# EAGLE board xio3 (EAGLE 9.4.2), part 1 of 3
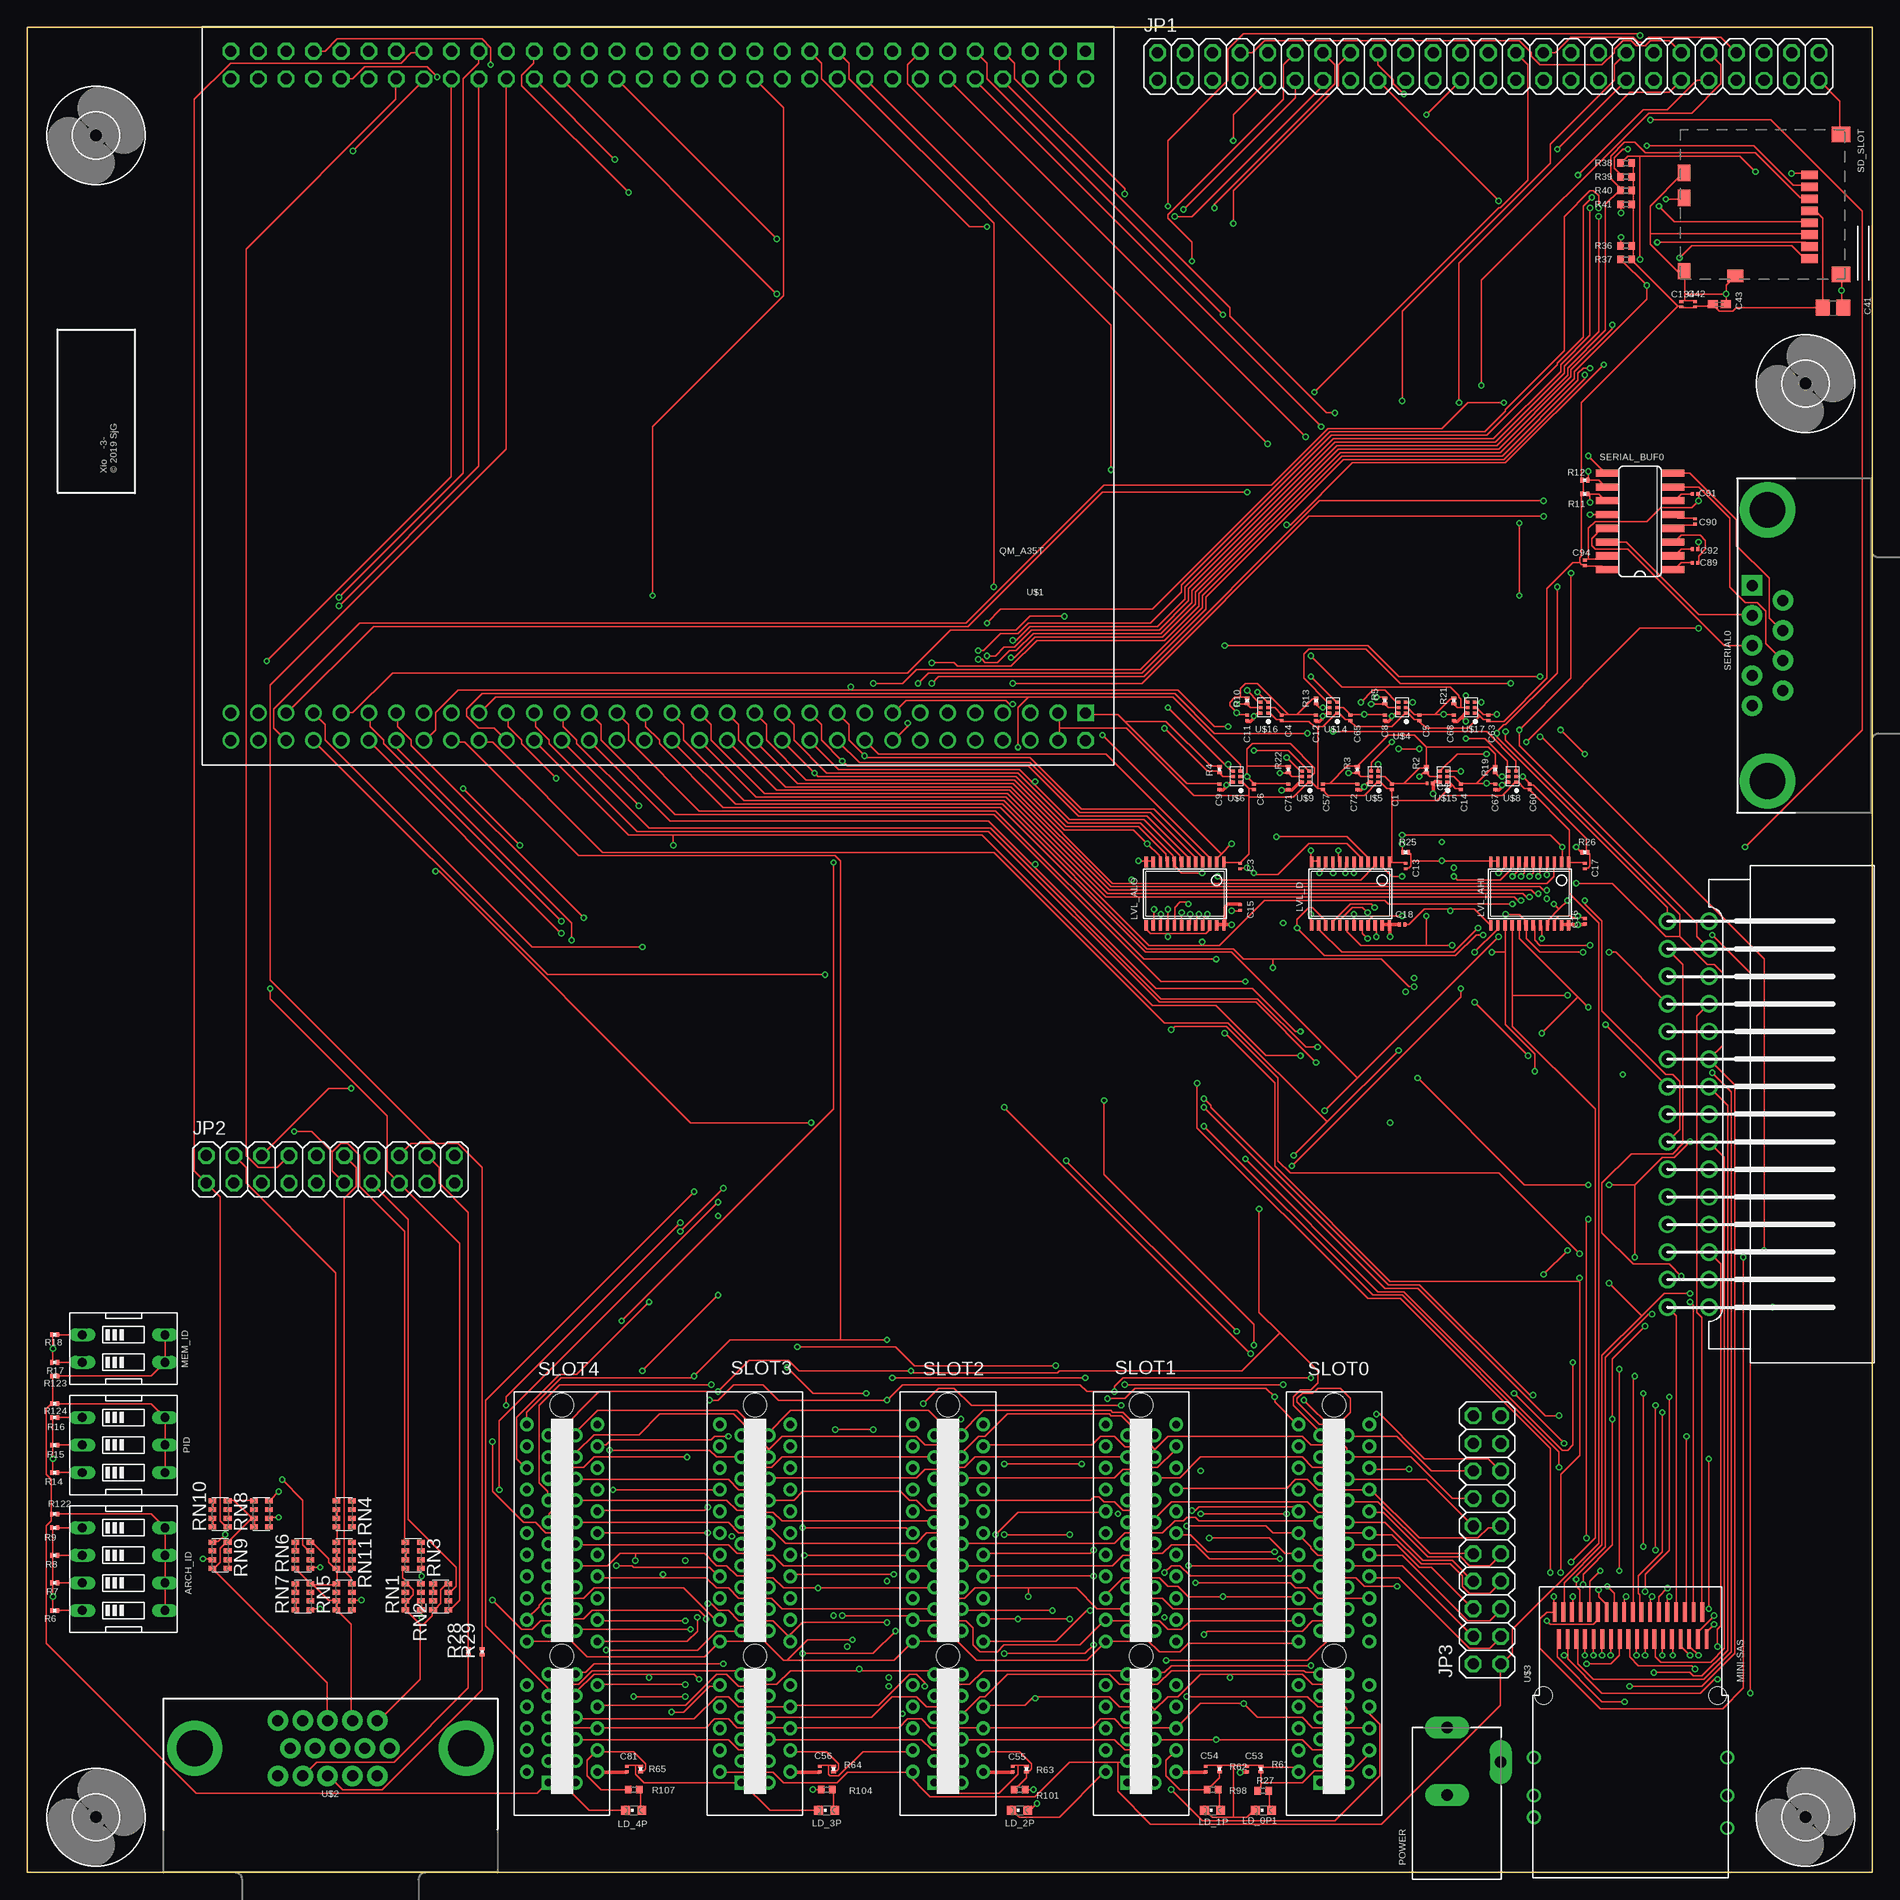
[diagram p14: board, top side]
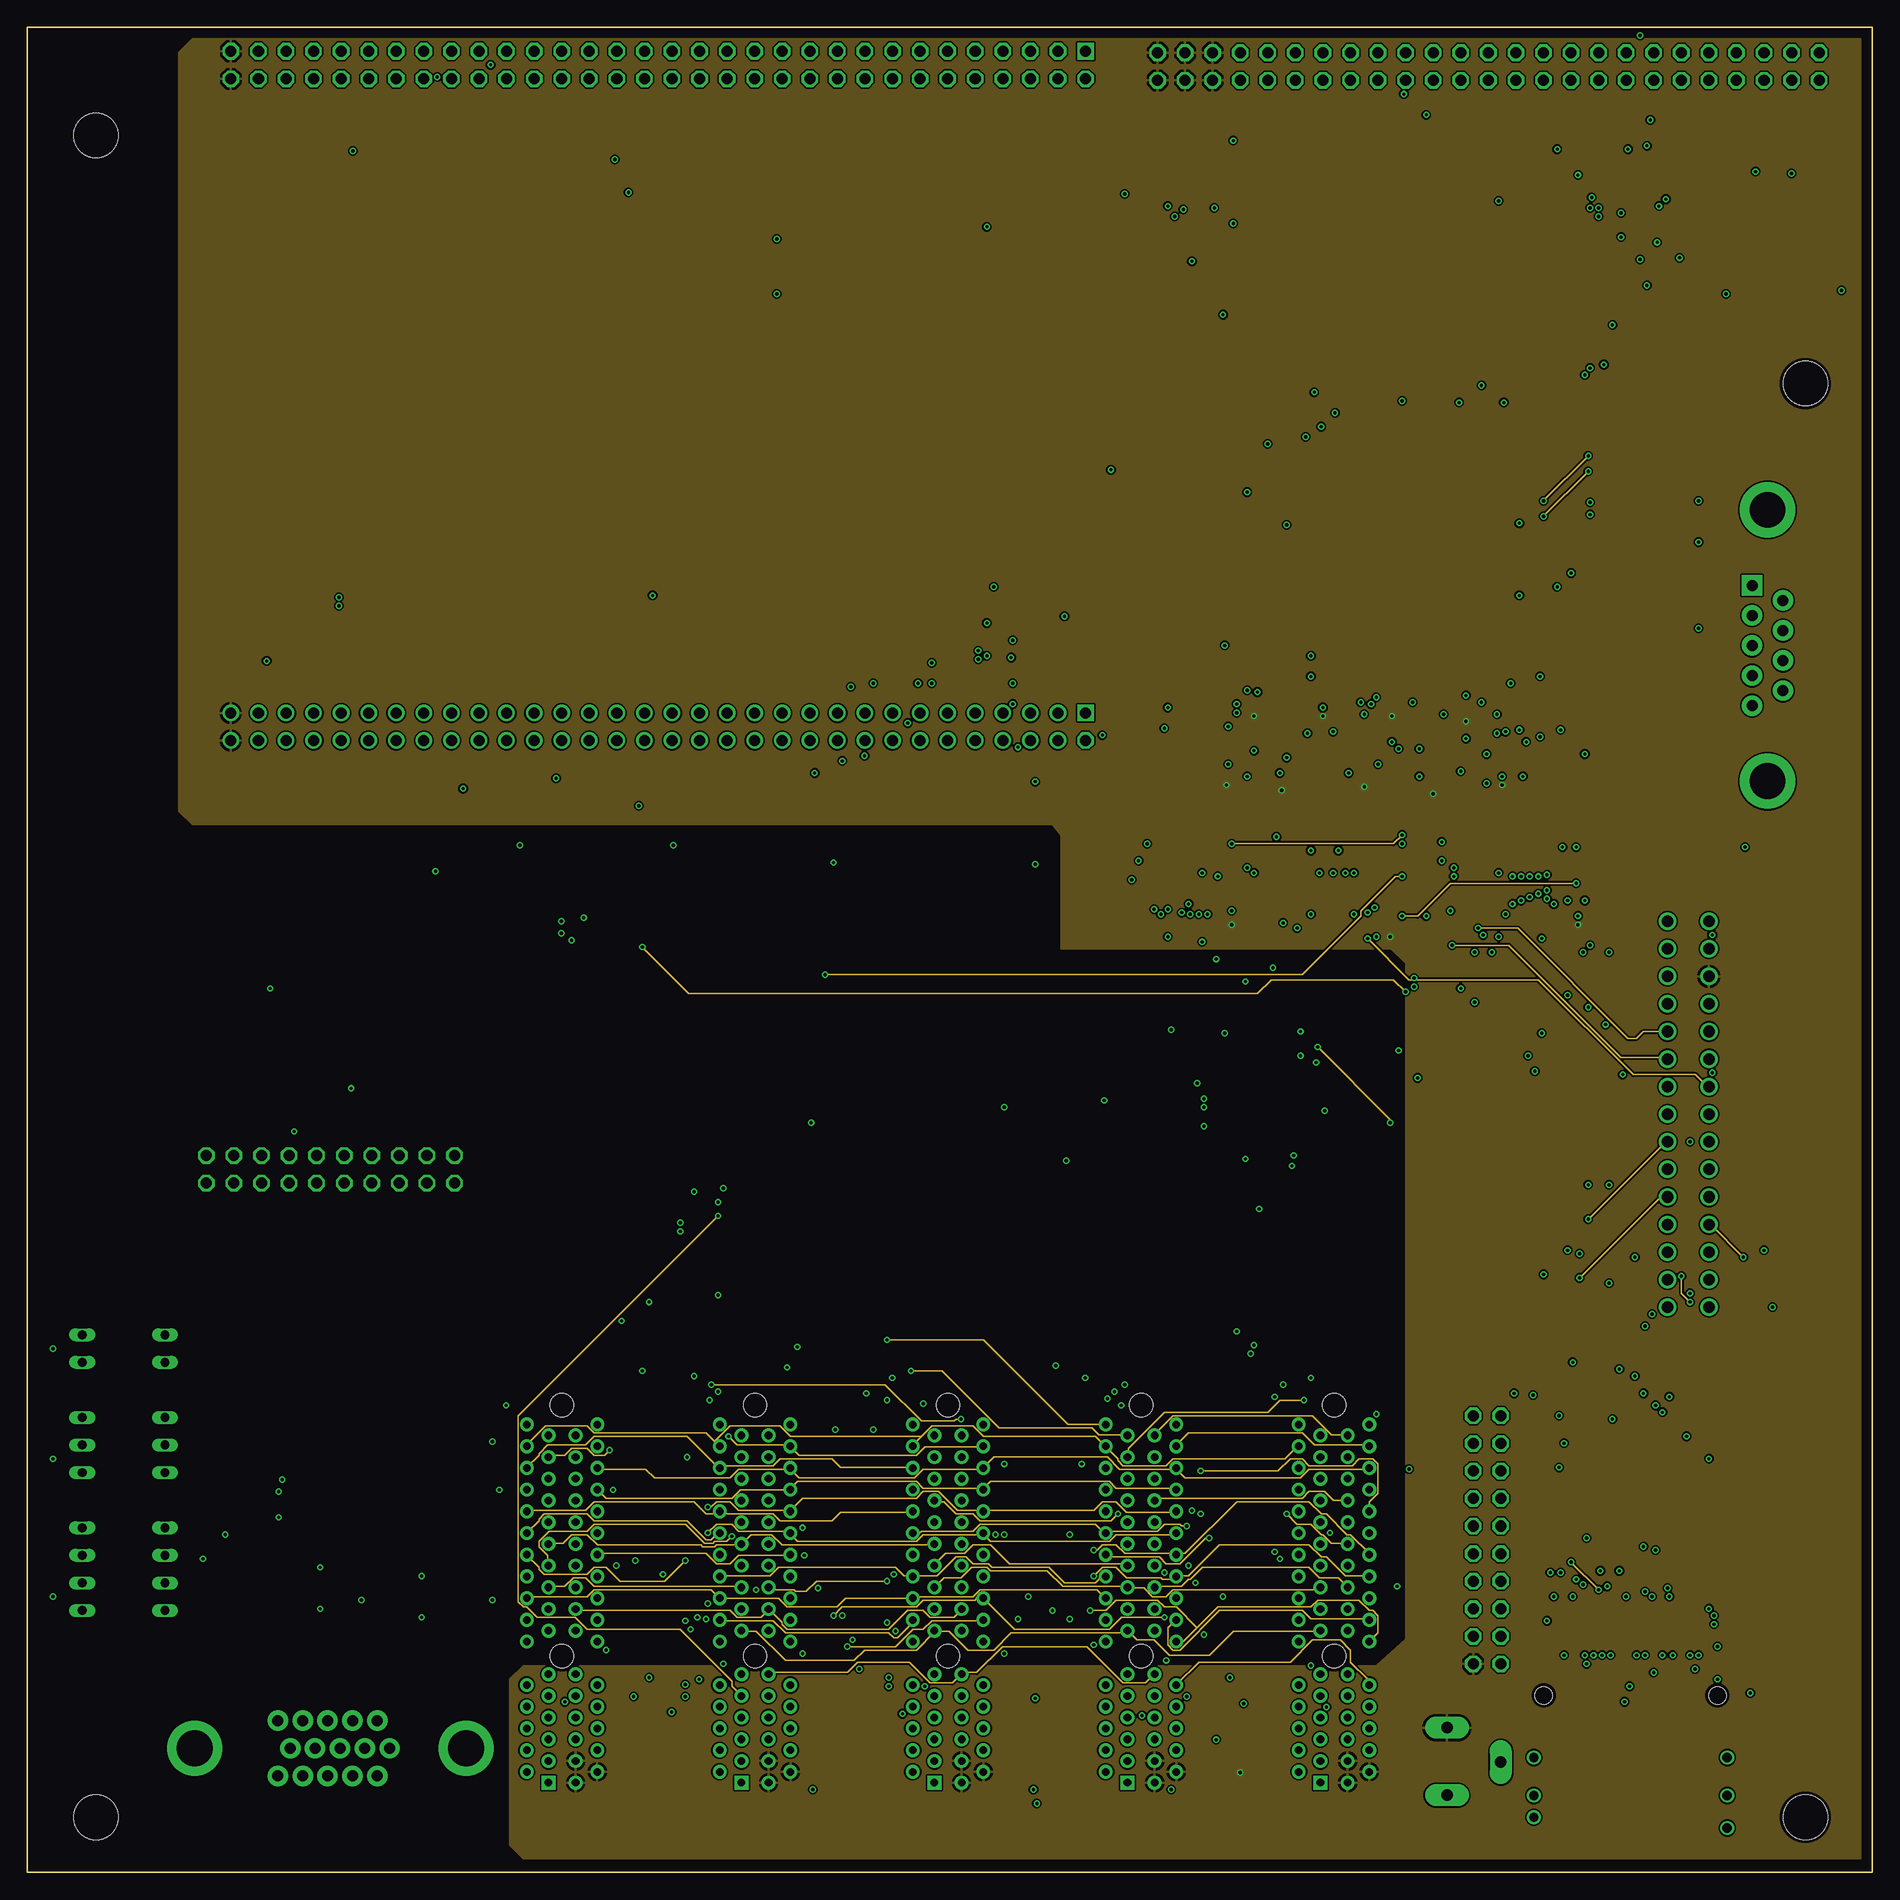
[diagram p15: board, inner layer Route2]
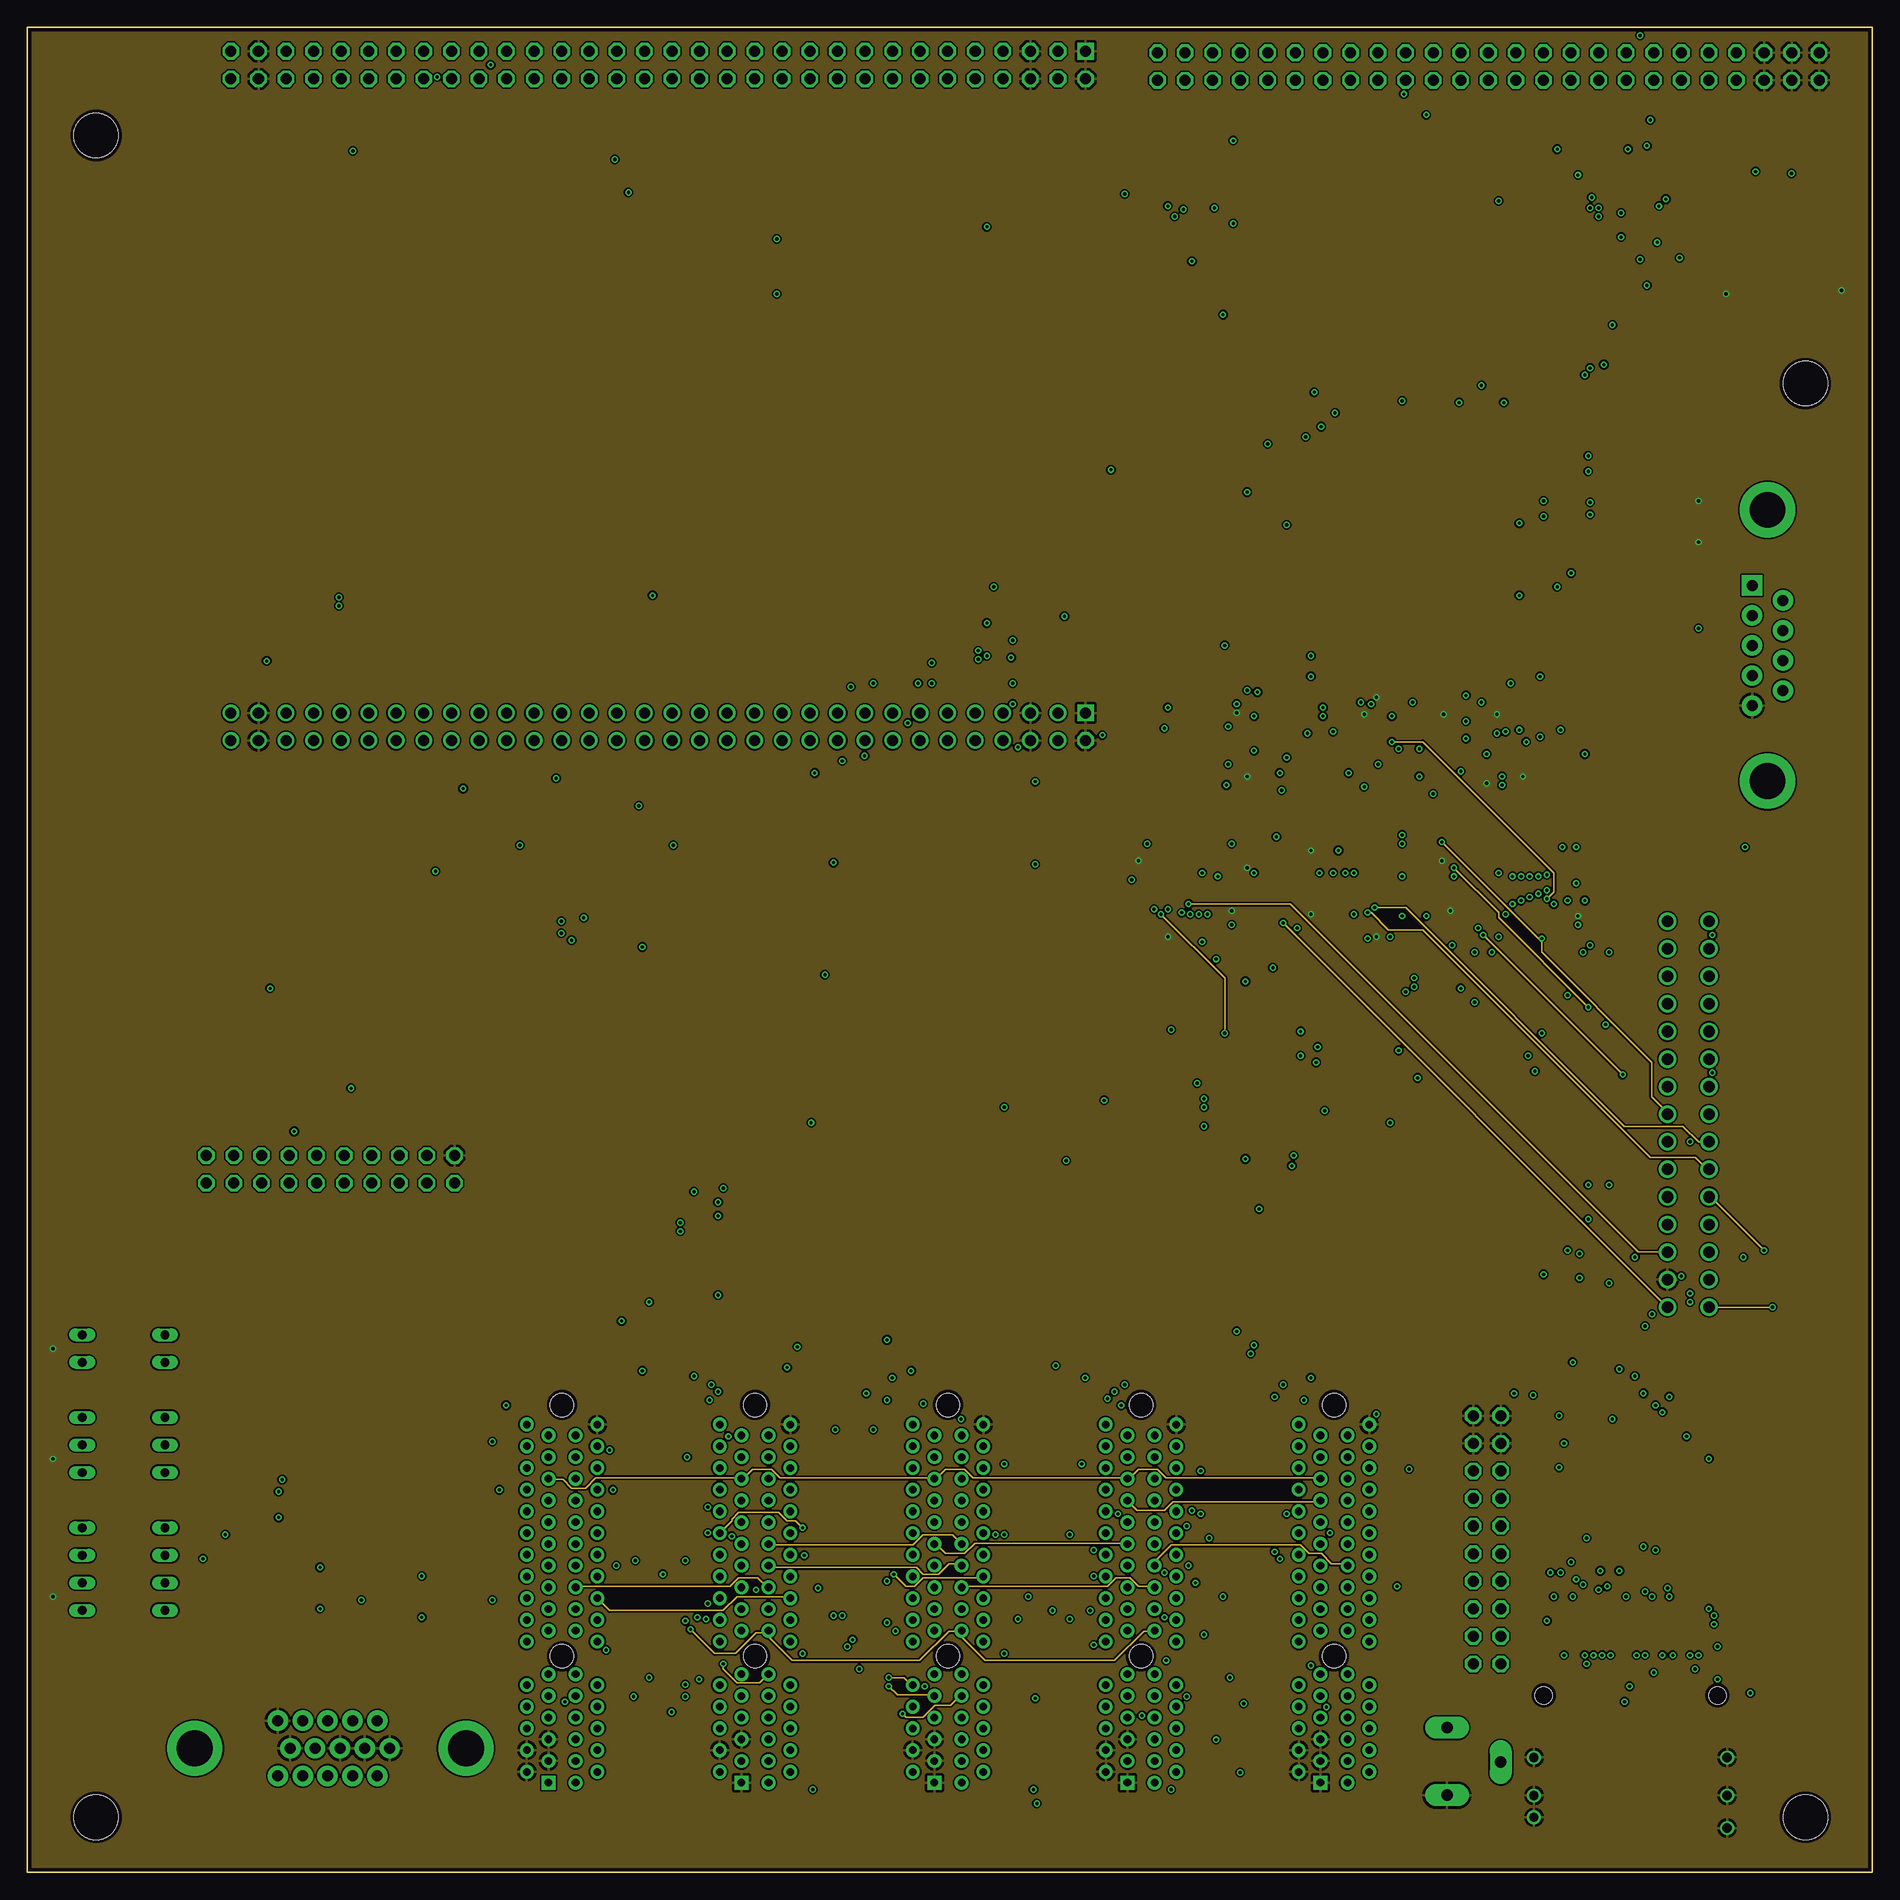
[diagram p16: board, inner layer Route15]
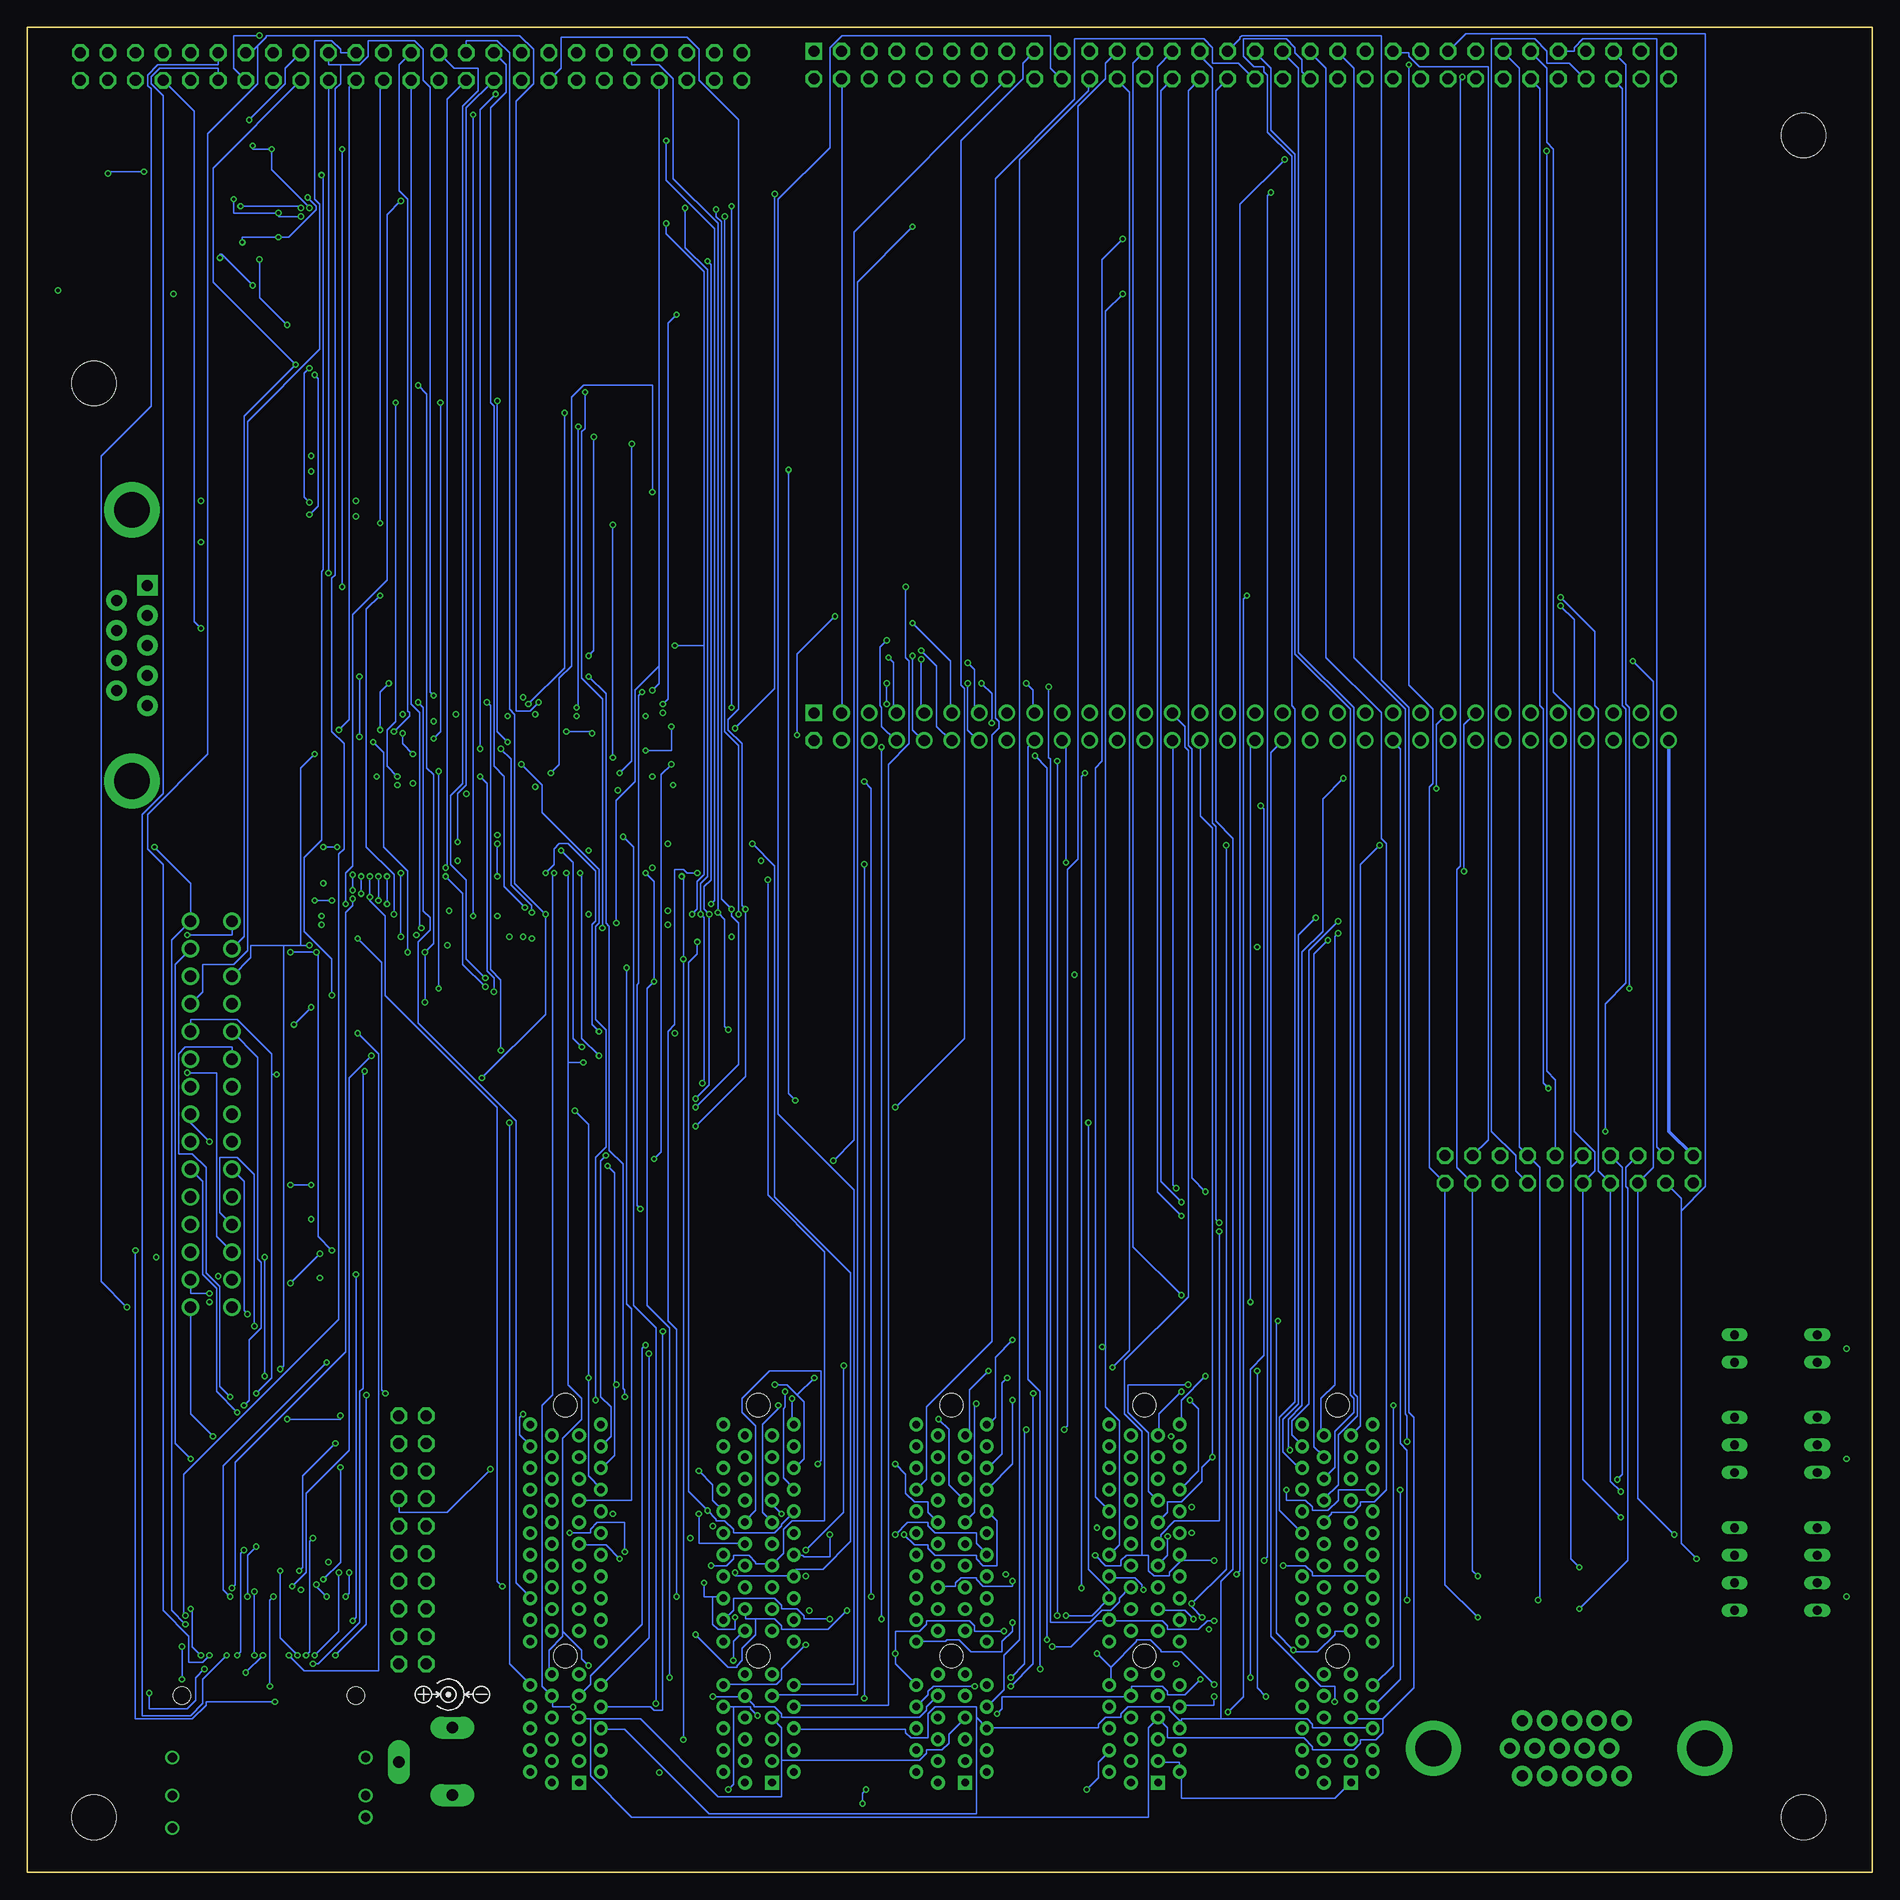
[diagram p17: board, bottom side, seen from below]

Size 170 x 170 mm. Coordinates in mm from the lower left corner, seen from the top.
Outline: 0,170 170,170 170,0 0,0 0,170
Copper layers (1+2*15+16): Top 0.035mm / dielectric 0.2mm / Route2 0.017mm / dielectric 1.2mm / Route15 0.017mm / dielectric 0.2mm / Bottom 0.035mm
Design rules "seed-4layer-6.6": minimum track width 6mil, minimum drill 0.3mm, track to track 6mil, track to pad 6mil, pad to pad 6mil, via to via 6mil, smd to smd 0mil, copper to edge 12mil, drill to drill 12mil, minimum pad ring 6mil, minimum via ring 5.5mil, stop-mask expansion 4mil, vias tented up to drill 25mil, thermal gap 10mil
Net classes: 1 Power: width 0.305 mm, drill 0.203 mm; 2 Slot-power: width 0.508 mm; 3 tx100: width 0.254 mm, clearance 0.457 mm; 4 usb90: width 0.254 mm, clearance 0.178 mm; 5 cclk50: width 0.203 mm; 6 3v3: width 0.254 mm; 7 vccint_aux: width 0.305 mm; 14 qspi: width 0.203 mm

## Footprints (pad centres in the part's own frame; a part is rotated, then mirrored left to right if it is on the bottom)
EDG-04 = drill 0.813 long: 1 -3.81,-3.81; 2 -1.27,-3.81; 3 1.27,-3.81; 4 3.81,-3.81; 5 3.81,3.81; 6 1.27,3.81; 7 -1.27,3.81; 8 -3.81,3.81
C0201 = smd 0.25 x 0.35: 1 -0.25,0; 2 0.25,0
C0805 = smd 1.3 x 1.5: 1 -0.95,0; 2 0.95,0
C0402K = smd 0.925 x 0.74: 1 -0.6,0; 2 0.6,0
A8_CART = drill 1.067: P1 -17.78,6.35; P2 -15.24,6.35; P3 -12.7,6.35; P4 -10.16,6.35; P5 -7.62,6.35; P6 -5.08,6.35; P7 -2.54,6.35; P8 0,6.35; P9 2.54,6.35; P10 5.08,6.35; P11 7.62,6.35; P12 10.16,6.35; P13 12.7,6.35; P14 15.24,6.35; P15 17.78,6.35; PA -17.78,10.16; PB -15.24,10.16; PC -12.7,10.16; PD -10.16,10.16; PE -7.62,10.16; PF -5.08,10.16; PH -2.54,10.16; PJ 0,10.16; PK 2.54,10.16; PL 5.08,10.16; PM 7.62,10.16; PN 10.16,10.16; PP 12.7,10.16; PR 15.24,10.16; PS 17.78,10.16
4,1 = hole 4.1: 0,0
2X25 = drill 1.016 octagon: 1 -30.48,-1.27; 2 -30.48,1.27; 3 -27.94,-1.27; 4 -27.94,1.27; 5 -25.4,-1.27; 6 -25.4,1.27; 7 -22.86,-1.27; 8 -22.86,1.27; 9 -20.32,-1.27; 10 -20.32,1.27; 11 -17.78,-1.27; 12 -17.78,1.27; 13 -15.24,-1.27; 14 -15.24,1.27; 15 -12.7,-1.27; 16 -12.7,1.27; 17 -10.16,-1.27; 18 -10.16,1.27; 19 -7.62,-1.27; 20 -7.62,1.27; 21 -5.08,-1.27; 22 -5.08,1.27; 23 -2.54,-1.27; 24 -2.54,1.27; 25 0,-1.27; 26 0,1.27; 27 2.54,-1.27; 28 2.54,1.27; 29 5.08,-1.27; 30 5.08,1.27; 31 7.62,-1.27; 32 7.62,1.27; 33 10.16,-1.27; 34 10.16,1.27; 35 12.7,-1.27; 36 12.7,1.27; 37 15.24,-1.27; 38 15.24,1.27; 39 17.78,-1.27; 40 17.78,1.27; 41 20.32,-1.27; 42 20.32,1.27; 43 22.86,-1.27; 44 22.86,1.27; 45 25.4,-1.27; 46 25.4,1.27; 47 27.94,-1.27; 48 27.94,1.27; 49 30.48,-1.27; 50 30.48,1.27
2X10 = drill 1.016 octagon: 1 -11.43,-1.27; 2 -11.43,1.27; 3 -8.89,-1.27; 4 -8.89,1.27; 5 -6.35,-1.27; 6 -6.35,1.27; 7 -3.81,-1.27; 8 -3.81,1.27; 9 -1.27,-1.27; 10 -1.27,1.27; 11 1.27,-1.27; 12 1.27,1.27; 13 3.81,-1.27; 14 3.81,1.27; 15 6.35,-1.27; 16 6.35,1.27; 17 8.89,-1.27; 18 8.89,1.27; 19 11.43,-1.27; 20 11.43,1.27
CHIPLED_0603 = smd 0.8 x 0.8: A 0,-0.75; C 0,0.75
TSSOP24 = smd 0.305 x 0.991: 1 -3.575,-2.918; 2 -2.925,-2.918; 3 -2.275,-2.918; 4 -1.625,-2.918; 5 -0.975,-2.918; 6 -0.325,-2.918; 7 0.325,-2.918; 8 0.975,-2.918; 9 1.625,-2.918; 10 2.275,-2.918; 11 2.925,-2.918; 12 3.575,-2.918; 13 3.575,2.918; 14 2.925,2.918; 15 2.275,2.918; 16 1.625,2.918; 17 0.975,2.918; 18 0.325,2.918; 19 -0.325,2.918; 20 -0.975,2.918; 21 -1.625,2.918; 22 -2.275,2.918; 23 -2.925,2.918; 24 -3.575,2.918
EDG-02 = drill 0.813 long: 1 -1.27,-3.81; 2 1.27,-3.81; 3 1.27,3.81; 4 -1.27,3.81
EDG-03 = drill 0.813 long: 1 -2.54,-3.81; 2 0,-3.81; 3 2.54,-3.81; 4 2.54,3.81; 5 0,3.81; 6 -2.54,3.81
DCJ3P-14.2X11.0X9.0MM = drill 1.067 pad 2.032 long: + 3.175,0; -1 -3.048,0; -2 0,-4.953
R0201 = smd 0.28 x 0.43: 1 -0.255,0; 2 0.255,0
R0402 = smd 0.6 x 0.7: 1 -0.5,0; 2 0.5,0
ACAS0612 = smd 0.45 x 0.7: 1A -1.2,-0.7; 1B -1.2,0.7; 2A -0.4,-0.7; 2B -0.4,0.7; 3A 0.4,-0.7; 3B 0.4,0.7; 4A 1.2,-0.7; 4B 1.2,0.7
5025700893 = smd 1.5 x 1.15: DTCT -0.6,-7.375; GND1 6.15,-7.375; GND3 -2.9,-7.375 | smd 1.4 x 1.7: GND0 6.45,7.1; GND2 -6.45,7.1 | smd 1.15 x 1.5: GND4 6.575,-2.65 | smd 0.8 x 1.5: P$1 -2.7,4.2; P$2 -1.6,4.2; P$3 -0.5,4.2; P$4 0.6,4.2; P$5 1.7,4.2; P$6 2.8,4.2; P$7 3.9,4.2; P$8 5,4.2
DB9 = drill 1.016 pad 1.88 square: 1 -5.54,-1.42 | drill 1.016 pad 1.88: 2 -2.77,-1.42; 3 0,-1.42; 4 2.77,-1.42; 5 5.54,-1.42; 6 -4.15,1.42; 7 -1.38,1.42; 8 1.38,1.42; 9 4.15,1.42 | drill 3.302 pad 5.08: G1 -12.5,0; G2 12.5,0
SO16 = smd 0.66 x 2.032: 1 -4.445,-3.073; 2 -3.175,-3.073; 3 -1.905,-3.073; 4 -0.635,-3.073; 5 0.635,-3.073; 6 1.905,-3.073; 7 3.175,-3.073; 8 4.445,-3.073; 9 4.445,3.073; 10 3.175,3.073; 11 1.905,3.073; 12 0.635,3.073; 13 -0.635,3.073; 14 -1.905,3.073; 15 -3.175,3.073; 16 -4.445,3.073
PCI-E_64 = drill 0.7 pad 1.27 square: A1 -12.06,1.5 | drill 0.7 pad 1.27: A2 -11.06,3.5; A3 -10.06,1.5; A4 -9.06,3.5; A5 -8.06,1.5; A6 -7.06,3.5; A7 -6.06,1.5; A8 -5.06,3.5; A9 -4.06,1.5; A10 -3.06,3.5; A11 -2.06,1.5; A12 0.94,3.5; A13 1.94,1.5; A14 2.94,3.5; A15 3.94,1.5; A16 4.94,3.5; A17 5.94,1.5; A18 6.94,3.5; A19 7.94,1.5; A20 8.94,3.5; A21 9.94,1.5; A22 10.94,3.5; A23 11.94,1.5; A24 12.94,3.5; A25 13.94,1.5; A26 14.94,3.5; A27 15.94,1.5; A28 16.94,3.5; A29 17.94,1.5; A30 18.94,3.5; A31 19.94,1.5; A32 20.94,3.5; B1 -12.06,-1; B2 -11.06,-3; B3 -10.06,-1; B4 -9.06,-3; B5 -8.06,-1; B6 -7.06,-3; B7 -6.06,-1; B8 -5.06,-3; B9 -4.06,-1; B10 -3.06,-3; B11 -2.06,-1; B12 0.94,-3; B13 1.94,-1; B14 2.94,-3; B15 3.94,-1; B16 4.94,-3; B17 5.94,-1; B18 6.94,-3; B19 7.94,-1; B20 8.94,-3; B21 9.94,-1; B22 10.94,-3; B23 11.94,-1; B24 12.94,-3; B25 13.94,-1; B26 14.94,-3; B27 15.94,-1; B28 16.94,-3; B29 17.94,-1; B30 18.94,-3; B31 19.94,-1; B32 20.94,-3 | hole 2.15: -0.41,0.25; 22.74,0.25
QMTECH = drill 1.016 square: U7_1 -39.37,29.21; U8_1 -39.37,-31.75 | drill 1.016 octagon: U7_2 -39.37,31.75; U8_2 -39.37,-29.21; U8_3 -36.83,-31.75; U8_4 -36.83,-29.21; U8_5 -34.29,-31.75; U8_6 -34.29,-29.21; U8_7 -31.75,-31.75; U8_8 -31.75,-29.21; U8_9 -29.21,-31.75; U8_10 -29.21,-29.21; U8_11 -26.67,-31.75; U8_12 -26.67,-29.21; U8_13 -24.13,-31.75; U8_14 -24.13,-29.21; U8_15 -21.59,-31.75; U8_16 -21.59,-29.21; U8_17 -19.05,-31.75; U8_18 -19.05,-29.21; U8_19 -16.51,-31.75; U8_20 -16.51,-29.21; U8_21 -13.97,-31.75; U8_22 -13.97,-29.21; U8_23 -11.43,-31.75; U8_24 -11.43,-29.21; U8_25 -8.89,-31.75; U8_26 -8.89,-29.21; U8_27 -6.35,-31.75; U8_28 -6.35,-29.21; U8_29 -3.81,-31.75; U8_30 -3.81,-29.21; U8_31 -1.27,-31.75; U8_32 -1.27,-29.21; U8_33 1.27,-31.75; U8_34 1.27,-29.21; U8_35 3.81,-31.75; U8_36 3.81,-29.21; U8_37 6.35,-31.75; U8_38 6.35,-29.21; U8_39 8.89,-31.75; U8_40 8.89,-29.21; U8_41 11.43,-31.75; U8_42 11.43,-29.21; U8_43 13.97,-31.75; U8_44 13.97,-29.21; U8_45 16.51,-31.75; U8_46 16.51,-29.21; U8_47 19.05,-31.75; U8_48 19.05,-29.21; U8_49 21.59,-31.75; U8_50 21.59,-29.21; U8_51 24.13,-31.75; U8_52 24.13,-29.21; U8_53 26.67,-31.75; U8_54 26.67,-29.21; U8_55 29.21,-31.75; U8_56 29.21,-29.21; U8_57 31.75,-31.75; U8_58 31.75,-29.21; U8_59 34.29,-31.75; U8_60 34.29,-29.21; U8_61 36.83,-31.75; U8_62 36.83,-29.21; U8_63 39.37,-31.75; U8_64 39.37,-29.21 | drill 1.016: U7_3 -36.83,29.21; U7_4 -36.83,31.75; U7_5 -34.29,29.21; U7_6 -34.29,31.75; U7_7 -31.75,29.21; U7_8 -31.75,31.75; U7_9 -29.21,29.21; U7_10 -29.21,31.75; U7_11 -26.67,29.21; U7_12 -26.67,31.75; U7_13 -24.13,29.21; U7_14 -24.13,31.75; U7_15 -21.59,29.21; U7_16 -21.59,31.75; U7_17 -19.05,29.21; U7_18 -19.05,31.75; U7_19 -16.51,29.21; U7_20 -16.51,31.75; U7_21 -13.97,29.21; U7_22 -13.97,31.75; U7_23 -11.43,29.21; U7_24 -11.43,31.75; U7_25 -8.89,29.21; U7_26 -8.89,31.75; U7_27 -6.35,29.21; U7_28 -6.35,31.75; U7_29 -3.81,29.21; U7_30 -3.81,31.75; U7_31 -1.27,29.21; U7_32 -1.27,31.75; U7_33 1.27,29.21; U7_34 1.27,31.75; U7_35 3.81,29.21; U7_36 3.81,31.75; U7_37 6.35,29.21; U7_38 6.35,31.75; U7_39 8.89,29.21; U7_40 8.89,31.75; U7_41 11.43,29.21; U7_42 11.43,31.75; U7_43 13.97,29.21; U7_44 13.97,31.75; U7_45 16.51,29.21; U7_46 16.51,31.75; U7_47 19.05,29.21; U7_48 19.05,31.75; U7_49 21.59,29.21; U7_50 21.59,31.75; U7_51 24.13,29.21; U7_52 24.13,31.75; U7_53 26.67,29.21; U7_54 26.67,31.75; U7_55 29.21,29.21; U7_56 29.21,31.75; U7_57 31.75,29.21; U7_58 31.75,31.75; U7_59 34.29,29.21; U7_60 34.29,31.75; U7_61 36.83,29.21; U7_62 36.83,31.75; U7_63 39.37,29.21; U7_64 39.37,31.75
DB15 = drill 1.016 pad 1.88: 1 -4.32,-7.62; 2 -2.03,-7.62; 3 0.26,-7.62; 4 2.55,-7.62; 5 4.84,-7.62; 6 -5.46,-5.08; 7 -3.17,-5.08; 8 -0.88,-5.08; 9 1.41,-5.08; 10 3.7,-5.08; 11 -4.32,-2.54; 12 -2.03,-2.54; 13 0.26,-2.54; 14 2.55,-2.54; 15 4.84,-2.54 | drill 3.302 pad 5.08: G1 -12.5,-5.08; G2 12.5,-5.08
MINI-SAS = smd 0.35 x 1.8: PA1 -6.2,8.78; PA2 -5.4,8.78; PA3 -4.6,8.78; PA4 -3.8,8.78; PA5 -3,8.78; PA6 -2.2,8.78; PA7 -1.4,8.78; PA8 -0.6,8.78; PA9 0.2,8.78; PA10 1,8.78; PA11 1.8,8.78; PA12 2.6,8.78; PA13 3.4,8.78; PA14 4.2,8.78; PA15 5,8.78; PA16 5.8,8.78; PA17 6.6,8.78; PA18 7.4,8.78; PB1 -6.6,11.29; PB2 -5.8,11.29; PB3 -5,11.29; PB4 -4.2,11.29; PB5 -3.4,11.29; PB6 -2.6,11.29; PB7 -1.8,11.29; PB8 -1,11.29; PB9 -0.2,11.29; PB10 0.6,11.29; PB11 1.4,11.29; PB12 2.2,11.29; PB13 3,11.29; PB14 3.8,11.29; PB15 4.6,11.29; PB16 5.4,11.29; PB17 6.2,11.29; PB18 7,11.29 | drill 0.85: SHIELD1 -8.5,-2.12; SHIELD2 -8.5,-5.62; SHIELD3 -8.5,-7.62; SHIELD4 9.3,-2.12; SHIELD5 9.3,-5.62; SHIELD6 9.3,-8.62 | hole 1.6: -7.6,3.6; 8.4,3.6
SOT886 = smd 0.325 x 0.27: 1 -0.338,0.5; 2 -0.338,0; 3 -0.338,-0.5; 4 0.338,-0.5; 5 0.338,0; 6 0.338,0.5

## Placement (x,y rotation side)
ARCH_ID  209-4MS  [EDG-04]  8.89,27.94 270 top
C1  0.1uF  [C0201]  125.73,100.01 90 top
C2  0.1uF  [C0201]  129.22,100.33 180 top
C3  0.1uF  [C0201]  111.76,92.71 270 top
C4  0.1uF  [C0201]  115.57,106.36 90 top
C5  0.1uF  [C0201]  128.27,106.36 90 top
C6  0.1uF  [C0201]  113.03,100.01 90 top
C8  0.1uF  [C0201]  125.09,106.36 90 top
C9  0.1uF  [C0201]  109.86,100.01 90 top
C11  0.1uF  [C0201]  112.39,106.36 90 top
C12  0.1uF  [C0201]  118.75,106.36 90 top
C13  0.1uF  [C0201]  127,92.71 270 top
C14  0.1uF  [C0201]  132.08,100.01 90 top
C15  0.1uF  [C0201]  111.76,88.9 270 top
C16  0.1uF  [C0201]  143.51,87.63 90 top
C17  0.1uF  [C0201]  143.51,92.71 270 top
C18  0.1uF  [C0201]  126.68,87.31 0 top
C41  22uF  [C0805]  166.37,144.15 0 top
C42  1uF  [C0201]  153.67,144.46 90 top
C43  10uF  [C0402K]  155.89,144.46 0 top
C53  0.1uF  [C0201]  112.39,9.53 90 top
C54  0.1uF  [C0201]  108.58,9.53 90 top
C55  0.1uF  [C0201]  90.81,9.53 90 top
C56  0.1uF  [C0201]  73.03,9.53 90 top
C57  0.1uF  [C0201]  119.38,100.01 90 top
C60  0.1uF  [C0201]  138.43,100.01 90 top
C63  0.1uF  [C0201]  134.62,106.36 90 top
C65  0.1uF  [C0201]  121.92,106.36 90 top
C67  0.1uF  [C0201]  135.25,100.01 90 top
C68  0.1uF  [C0201]  131.44,106.36 90 top
C71  0.1uF  [C0201]  116.2,100.01 90 top
C72  0.1uF  [C0201]  122.56,100.01 90 top
C81  0.1uF  [C0201]  55.24,9.53 90 top
C89  0.1uF  [C0201]  153.67,120.65 180 top
C90  0.1uF  [C0201]  153.67,124.46 270 top
C91  0.1uF  [C0201]  153.67,127 0 top
C92  0.1uF  [C0201]  153.67,121.92 0 top
C94  0.1uF  [C0201]  143.51,120.65 270 top
C134  0.1uF  [C0201]  152.4,144.46 270 top
CARTRIDGE  5650118-1  [A8_CART]  161.29,69.85 90 top
H3  MOUNT-HOLE4.1  [4,1]  6.35,5.08 0 top
H6  MOUNT-HOLE4.1  [4,1]  6.35,160.02 0 top
H7  MOUNT-HOLE4.1  [4,1]  163.83,137.16 0 top
H8  MOUNT-HOLE4.1  [4,1]  163.83,5.08 0 top
JP1  [2X25]  134.62,166.37 0 top
JP2  [2X10]  27.94,64.77 0 top
JP3  [2X10]  134.5,30.63 90 top
LD_0P1  SML-D12D1WT86  [CHIPLED_0603]  113.92,5.71 90 top
LD_1P  SML-D12D1WT86  [CHIPLED_0603]  109.22,5.71 90 top
LD_2P  SML-D12D1WT86  [CHIPLED_0603]  91.44,5.71 90 top
LD_3P  SML-D12D1WT86  [CHIPLED_0603]  73.66,5.71 90 top
LD_4P  SML-D12D1WT86  [CHIPLED_0603]  55.88,5.71 90 top
LVL_AHI  SN74LVC8T245  [TSSOP24]  138.43,90.17 180 top
LVL_ALO  SN74LVC8T245  [TSSOP24]  106.68,90.17 180 top
LVL_D  SN74LVC8T245  [TSSOP24]  121.92,90.17 180 top
MEM_ID  209-2MS  [EDG-02]  8.89,48.26 270 top
PID  209-3MS  [EDG-03]  8.89,39.37 270 top
POWER  dc5vin  [DCJ3P-14.2X11.0X9.0MM]  130.81,10.16 90 top
R2  10K  [R0201]  128.91,101.6 90 top
R3  10K  [R0201]  122.56,101.6 90 top
R4  10K  [R0201]  109.86,101.6 90 top
R5  10K  [R0201]  125.09,107.95 90 top
R6  47K  [R0201]  2.54,24.13 180 top
R7  47K  [R0201]  2.54,26.67 180 top
R8  47K  [R0201]  2.54,29.21 180 top
R9  47K  [R0201]  2.54,31.75 180 top
R10  10K  [R0201]  112.39,107.95 90 top
R11  1K  [R0201]  143.51,127 0 top
R12  1K  [R0201]  143.51,128.27 0 top
R13  10K  [R0201]  118.75,107.95 90 top
R14  47K  [R0201]  2.54,36.83 180 top
R15  47K  [R0201]  2.54,39.37 180 top
R16  47K  [R0201]  2.54,41.91 180 top
R17  47K  [R0201]  2.54,46.99 180 top
R18  47K  [R0201]  2.54,49.53 180 top
R19  10K  [R0201]  135.25,101.6 90 top
R21  10K  [R0201]  131.44,107.95 90 top
R22  10K  [R0201]  116.2,101.6 90 top
R25  10K  [R0201]  127,93.98 0 top
R26  10K  [R0201]  143.51,93.98 0 top
R27  59R  [R0402]  113.87,7.52 0 top
R28  100R  [R0201]  40.64,20.32 90 top
R29  100R  [R0201]  41.91,20.32 90 top
R36  4K7  [R0402]  147.32,149.86 0 top
R37  4K7  [R0402]  147.32,148.59 0 top
R38  4K7  [R0402]  147.32,157.48 0 top
R39  4K7  [R0402]  147.32,156.21 0 top
R40  4K7  [R0402]  147.32,154.94 0 top
R41  4K7  [R0402]  147.32,153.67 0 top
R61  10K  [R0201]  113.67,9.53 270 top
R62  10K  [R0201]  109.86,9.53 270 top
R63  10K  [R0201]  92.08,9.53 270 top
R64  10K  [R0201]  74.3,9.53 270 top
R65  10K  [R0201]  56.52,9.53 270 top
R98  59R  [R0402]  109.22,7.62 0 top
R101  59R  [R0402]  91.44,7.62 0 top
R104  59R  [R0402]  73.66,7.62 0 top
R107  59R  [R0402]  55.88,7.62 0 top
R122  1K  [R0201]  2.54,33.02 0 top
R123  1K  [R0201]  2.54,45.72 0 top
R124  1K  [R0201]  2.54,43.18 0 top
RN1  1K  [ACAS0612]  35.56,25.4 90 top
RN2  2K  [ACAS0612]  38.1,25.4 90 top
RN3  2K  [ACAS0612]  35.56,29.21 270 top
RN4  2K  [ACAS0612]  29.21,33.02 270 top
RN5  1K  [ACAS0612]  29.21,25.4 90 top
RN6  2K  [ACAS0612]  25.4,29.21 90 top
RN7  2K  [ACAS0612]  25.4,25.4 90 top
RN8  1K  [ACAS0612]  21.59,33.02 90 top
RN9  2K  [ACAS0612]  17.78,29.21 270 top
RN10  2K  [ACAS0612]  17.78,33.02 90 top
RN11  2K  [ACAS0612]  29.21,29.21 270 top
SD_SLOT  5025700893  [5025700893]  160.02,153.67 270 top
SERIAL0  9-way D  [DB9]  160.34,113.03 270 top
SERIAL_BUF0  MAX3232ECDR  [SO16]  148.59,124.46 90 top
SLOT0  PCIE_64  [PCI-E_64]  120.65,20.32 90 top
SLOT1  PCIE_64  [PCI-E_64]  102.87,20.32 90 top
SLOT2  PCIE_64  [PCI-E_64]  85.09,20.32 90 top
SLOT3  PCIE_64  [PCI-E_64]  67.31,20.32 90 top
SLOT4  PCIE_64  [PCI-E_64]  49.53,20.32 90 top
U$1  QM_A35T  [QMTECH]  58.14,136.03 180 top
U$2  DB15  [DB15]  27.94,6.35 180 top
U$3  MINI-SAS  [MINI-SAS]  147.32,12.7 0 top
U$4  74LVC1T45GWSOT866  [SOT886]  126.68,107.31 180 top
U$5  74LVC1T45GWSOT866  [SOT886]  124.14,100.97 180 top
U$6  74LVC1T45GWSOT866  [SOT886]  111.44,100.97 180 top
U$8  74LVC1T45GWSOT866  [SOT886]  136.84,100.97 180 top
U$9  74LVC1T45GWSOT866  [SOT886]  117.79,100.97 180 top
U$14  74LVC1T45GWSOT866  [SOT886]  120.33,107.31 180 top
U$15  74LVC1T45GWSOT866  [SOT886]  130.49,100.97 180 top
U$16  74LVC1T45GWSOT866  [SOT886]  113.98,107.31 180 top
U$17  74LVC1T45GWSOT866  [SOT886]  133.03,107.31 180 top

## Tracks (layer width: path | path; a pad name or v marks a point on that pad's centre or on a via)
!HI_CCTL!  (via drill 0.3)
  Top 0.152: v155.42,22.86 154.78,22.23 154.78,21.59 U$3.PA18 | v149.54,161.45 160.66,161.45 169.07,153.03 169.07,105.25 v158.27,94.46
  Bottom 0.152: v155.42,22.86 156.69,24.13 156.69,85.88 CARTRIDGE.P15 154.94,91.12 v158.27,94.46 | JP1.34 146.21,166.21 146.21,164.78 v149.54,161.45
!HI_EXTSEL!  (via drill 0.3)
  Top 0.152: v125.73,104.14 123.83,102.23 123.83,101.44 U$5.4 | v126.68,135.57 126.68,143.83 140.34,157.48 140.34,159.23 146.21,165.1 146.21,166.53 JP1.36 | v151.13,26.19 150.34,25.4 150.34,24.13 U$3.PB13
  Route15 0.152: v140.02,89.69 140.65,90.33 140.65,92.08 128.59,104.14 v125.73,104.14
  Bottom 0.152: v125.73,104.14 126.68,105.09 v126.68,135.57 | v151.13,26.19 150.81,26.51 150.81,37.78 140.65,47.94 140.65,88.42 140.02,89.06 v140.02,89.69
!HI_HALT!  (via drill 0.3)
  Top 0.152: v132.56,104.46 134.3,104.46 136.37,102.39 136.37,101.44 U$8.4 | v131.92,135.41 131.92,148.27 147.64,163.99 151.29,163.99 JP1.39 | v151.61,20 151.61,21.43 U$3.PA14
  Bottom 0.152: v132.56,104.46 131.92,105.09 v131.92,135.41 | v151.61,20 153.83,17.78 153.83,15.56 154.94,14.45 159.38,14.45 159.38,97.47 157.48,99.38 157.48,163.67 158.59,164.78 158.59,165.42 157.8,166.21 152.4,166.21 JP1.39
!HI_IRQ!  (via drill 0.3)
  Top 0.152: v105.09,107.31 110.49,101.92 | 110.49,101.92 110.97,101.44 U$6.4 | v105.09,153.51 105.09,159.54 110.65,165.1 110.65,167.96 112.08,169.39 148.43,169.39 v148.59,169.23 | v151.29,25.4 151.13,25.24 151.13,24.13 U$3.PB14 | v142.4,46.99 142.4,39.37 141.92,38.89 141.45,38.89 126.84,53.5 124.46,53.5 v112.24,65.72 | 110.49,101.92 v110.65,102.08
  Bottom 0.152: v105.09,153.51 v105.09,107.31 | v148.59,169.23 150.97,169.23 150.97,166.21 JP1.37 | v151.29,25.4 151.92,26.04 151.92,37.47 v142.4,46.99 | v112.24,65.72 111.6,66.36 111.6,101.12 v110.65,102.08
!HI_MPD!  (via drill 0.3)
  Top 0.152: v122.87,107.79 123.98,108.9 125.09,108.9 126.21,107.79 U$4.4 | v153.19,20 152.4,20.8 152.4,21.43 U$3.PA15
  Bottom 0.152: v122.87,107.79 123.67,107 124.94,107 124.94,163.19 123.35,164.78 123.35,167.96 124.62,169.23 147.96,169.23 147.96,169.07 148.75,168.28 | 148.75,168.28 149.38,167.64 JP1.38 | v153.19,20 153.83,19.37 155.1,19.37 155.1,21.75 157.48,24.13 157.48,92.87 158.91,94.3 158.91,97.47 153.35,103.03 153.35,160.18 148.75,164.78 148.75,168.28
!HI_RST!  (via drill 0.3)
  Top 0.152: v132.56,108.43 132.56,107.79 U$17.4 | v155.42,23.65 153.99,22.23 153.99,21.59 U$3.PA17
  Bottom 0.152: v132.56,108.43 132.87,108.74 132.87,164.47 133.51,165.1 133.51,167.96 134.3,168.75 138.59,168.75 138.59,167.32 139.38,166.53 141.13,166.53 | 141.13,166.53 142.24,166.53 JP1.32 | v155.42,23.65 155.57,23.81 155.57,36.67 141.29,50.96 141.29,93.82 140.81,94.3 140.81,103.98 141.92,105.09 141.92,119.22 141.6,119.54 141.6,164.31 141.13,164.78 141.13,166.53
!HI_S4!  (via drill 0.3)
  Top 0.152: v152.88,40.16 152.88,24.13 U$3.PB16 | JP1.8 112.87,167.64 113.98,168.75 137.48,168.75 138.59,167.64 138.59,167.32 139.38,166.53 145.1,166.53 146.21,167.64 146.21,167.96 147,168.75 147.8,168.75 148.27,168.28 149.07,168.28 149.54,168.75 151.29,168.75 JP1.40
  Route15 0.152: v160.81,52.07 CARTRIDGE.P1
  Bottom 0.152: v152.88,40.16 154.94,42.23 CARTRIDGE.P1 | v160.81,52.07 163.19,54.45 163.19,130.49 158.59,135.1 158.59,164.31 158.91,164.62 158.91,165.58 157.96,166.53 152.4,166.53 JP1.40
!HI_S5!
  Top 0.152: JP1.30 140.81,167.64 142.24,169.07 147.96,169.07 148.43,168.59 148.91,168.59 149.38,169.07 156.05,169.07 JP1.44 | CARTRIDGE.P12 153.83,78.9 153.83,51.59 154.31,51.12 154.31,24.13 U$3.PB18
  Bottom 0.152: JP1.30 141.13,167.64 141.13,167.96 141.92,168.75 143.51,168.75 143.51,154.15 143.03,153.67 143.03,140.34 149.7,133.67 149.7,84.93 150.97,83.66 153.83,83.66 153.83,81.12 CARTRIDGE.P12
!LO_CCTL!
  Route15 0.152: SLOT4.A27 48.1,36.2 49.37,36.2 50.16,35.4 51.44,35.4 52.39,36.35 65.72,36.35 SLOT3.A27 65.88,36.2 66.83,37.15 68.58,37.15 69.37,36.35 83.5,36.35 SLOT2.A27 83.66,36.2 84.61,37.15 86.36,37.15 87.15,36.35 101.28,36.35 SLOT1.A27 101.44,36.2 102.39,37.15 104.14,37.15 104.93,36.35 119.06,36.35 SLOT0.A27
!LO_EXTSEL!  (via drill 0.3)
  Top 0.152: v124.46,102.08 124.46,101.44 U$5.3 | v117.63,43.5 120.33,40.8 120.33,39.53 119.22,38.42 SLOT0.A29 | v53.66,38.89 62.87,38.89 63.5,38.26 65.72,38.26 SLOT3.A29 65.88,38.26 66.83,37.31 68.58,37.31 69.53,38.26 83.5,38.26 SLOT2.A29 83.66,38.26 84.61,37.31 86.36,37.31 87.31,38.26 101.28,38.26 SLOT1.A29 | v48.74,100.81 45.56,103.98 45.56,104.3 44.29,105.57 44.29,106.68 U$1.U7_43
  Route2 0.152: v53.66,38.89 53.18,38.42 52.23,38.42 51.59,39.05 50.16,39.05 49.53,38.42 48.1,38.42 SLOT4.A29 | v117.63,43.5 115.41,43.5 114.3,42.39 104.78,42.39 101.44,39.05 101.44,38.42 SLOT1.A29
  Bottom 0.152: v124.46,102.08 122.56,100.17 122.56,97.63 117.32,92.39 117.32,87.47 117.63,87.15 117.63,78.58 116.68,77.63 116.68,66.83 117.63,65.88 v117.63,43.5 | v48.74,100.81 50.64,98.9 50.64,86.68 52.55,84.77 52.55,43.02 53.82,41.75 53.82,39.05 v53.66,38.89
!LO_HALT!  (via drill 0.3)
  Top 0.152: v104.93,19.53 117.95,19.53 120.65,22.23 121.6,22.23 SLOT0.B13 | v61.12,22.38 50.64,22.38 SLOT4.B13 50.48,22.38 49.21,22.38 48.42,23.18 47.31,23.18 46.51,22.38 45.56,22.38 v42.86,25.08 | v120.33,105.09 134.46,105.09 137.16,102.39 137.16,101.44 U$8.3 | v117.95,104.93 109.38,104.93 105.73,108.58 41.91,108.58 40.48,107.16 40.48,106.52 41.59,105.41 43.02,105.41 44.13,104.3 U$1.U7_44
  Route15 0.152: v61.12,22.38 63.34,20.16 65.25,20.16 67.15,22.07 67.94,22.07 | 67.94,22.07 68.1,22.07 68.26,22.23 SLOT3.B13 67.94,22.07 | 85.57,22.23 84.93,22.23 82.23,19.53 70.48,19.53 67.94,22.07 | 85.57,22.23 86.04,22.23 SLOT2.B13 85.57,22.23 | 85.57,22.23 88.27,19.53 100.17,19.53 102.87,22.23 103.82,22.23 SLOT1.B13
  Bottom 0.152: v104.93,19.53 104.93,21.27 103.98,22.23 SLOT1.B13 | v120.33,105.09 117.95,105.09 v117.95,104.93 | v42.86,25.08 42.86,38.89 43.5,39.53 43.5,103.5 44.13,104.14 U$1.U7_44
!LO_IRQ!  (via drill 0.3)
  Top 0.152: v60.64,23.18 52.55,23.18 SLOT4.B14 | v96.04,23.34 v91.28,23.34 88.11,23.34 SLOT2.B14 | 92.23,108.27 43.18,108.27 41.75,106.84 U$1.U7_45 | 92.23,108.27 105.57,108.27 111.76,102.08 111.76,101.44 U$6.3 | v91.28,103.66 91.28,107.31 92.23,108.27
  Route2 0.152: SLOT0.B14 123.51,23.34 118.27,23.34 117.47,24.13 109.86,24.13 106.2,20.48 105.57,20.48 105.09,20.95 105.09,22.54 105.73,23.18 SLOT1.B14 | v75.56,20.8 80.01,20.8 81.6,22.38 82.55,22.38 83.34,23.18 87.95,23.18 SLOT2.B14
  Bottom 0.152: v60.64,23.18 61.28,23.18 62.07,22.38 64.93,22.38 64.93,22.7 65.41,23.18 70.17,23.18 SLOT3.B14 70.33,23.18 71.44,23.18 73.82,20.8 v75.56,20.8 | v96.04,23.34 98.42,23.34 98.42,23.65 99.06,24.29 100.49,24.29 100.49,24.61 101.12,25.24 104.93,25.24 104.93,24.13 105.73,23.34 SLOT1.B14 | v91.28,103.66 v91.28,23.34
!LO_MPD!  (via drill 0.3)
  Top 0.152: v127.64,107.79 127.16,107.79 U$4.3 | v116.68,66.04 119.86,69.22 | 119.86,69.22 v126.36,75.72 | 119.86,69.22 119.7,69.22 110.65,78.26 104.78,78.26 89.06,93.98 53.02,93.98 42.86,104.14 41.75,104.14 U$1.U7_46
  Route2 0.152: 63.34,39.69 63.66,39.37 SLOT3.A30 | 63.34,39.69 62.55,40.48 52.23,40.48 51.59,41.12 47.78,41.12 46.04,39.37 SLOT4.A30 | 82.39,40.16 83.34,41.12 87.15,41.12 88.11,40.16 98.42,40.16 99.22,39.37 SLOT1.A30 99.38,39.21 100.49,38.1 100.49,37.94 100.97,37.47 104.93,37.47 105.57,38.1 115.89,38.1 117,39.21 SLOT0.A30 | 82.39,40.16 81.6,39.37 SLOT2.A30 | 63.34,39.69 64.77,41.12 69.37,41.12 70.33,40.16 82.39,40.16
  Bottom 0.152: v127.64,107.79 127.32,107.47 127.32,83.19 126.36,82.23 v126.36,75.72 | v116.68,66.04 117.16,65.56 117.16,43.81 116.2,42.86 116.2,40.16 117,39.37 SLOT0.A30
!LO_REF!  (via drill 0.3)
  Top 0.152: v94.46,24.13 86.2,24.13 SLOT2.B15 | v108.43,21.91 108.74,22.23 117.47,22.23 118.43,23.18 119.38,23.18 120.33,24.13 121.6,24.13 SLOT0.B15
  Route2 0.152: SLOT4.B15 50.64,24.13 64.77,24.13 65.41,23.5 67.63,23.5 68.26,24.13 SLOT3.B15 68.42,24.13 69.53,23.02 69.53,22.86 70.01,22.38 79.38,22.38 81.12,24.13 82.55,24.13 83.19,23.5 85.41,23.5 86.04,24.13 SLOT2.B15
  Bottom 0.152: v94.46,24.13 96.2,22.38 100.49,22.38 100.49,22.7 101.12,23.34 102.87,23.34 | 102.87,23.34 103.82,23.34 103.82,24.13 SLOT1.B15 | v108.43,21.91 105.41,18.89 104.62,18.89 104.62,19.05 104.14,19.53 104.14,20.64 102.87,21.91 102.87,23.34
!LO_RST!  (via drill 0.3)
  Top 0.152: v133.99,107.79 133.51,107.79 U$17.3 | v107.63,26.67 116.36,26.67 116.84,26.19 117.95,26.19 118.9,25.24 123.51,25.24 SLOT0.B16 | v37.62,92.23 37.94,92.23 61.12,69.06 v72.23,69.06
  Route2 0.152: v74.3,23.65 75.09,24.45 81.92,24.45 82.55,25.08 87.31,25.08 87.47,25.24 87.95,25.24 SLOT2.B16 88.11,25.24 90.96,22.38 99.69,22.38 100.81,23.5 v104.78,23.5
  Route15 0.152: SLOT4.B16 52.55,25.24 53.66,24.13 64.14,24.13 65.41,25.4 70.17,25.4 SLOT3.B16
  Bottom 0.152: v133.99,107.79 133.51,107.31 133.51,88.58 132.87,87.95 132.87,86.84 133.99,85.72 133.99,78.26 124.94,69.22 124.94,26.67 123.67,25.4 SLOT0.B16 | 106.84,25.4 107.63,25.4 v107.63,26.67 | 106.84,25.4 105.89,25.4 SLOT1.B16 | v74.3,23.65 71.91,23.65 70.33,25.24 SLOT3.B16 70.33,25.4 70.33,26.04 72.23,27.94 v72.23,69.06 | v37.62,92.23 37.62,105.73 36.67,106.68 U$1.U7_49 | 106.84,25.4 106.84,22.86 106.36,22.38 104.78,22.38 v104.78,23.5
+3V3
  Top 0.152: C41.1 165.42,152.4 164.78,153.03 164.31,153.03 SD_SLOT.P$4 | SERIAL_BUF0.16 145.41,120.02 145.1,120.33 143.51,120.33 C94.2 143.51,120.49 143.19,120.49 143.03,120.65 | 143.03,120.65 143.03,121.13 143.19,121.28 143.19,127 R11.1 143.35,127 143.35,128.27 R12.1 143.19,128.27 143.19,135.41 152.08,144.3 | 155.26,144.46 155.1,144.3 153.67,144.3 C42.1 153.67,144.15 152.4,144.15 C134.2 152.4,144.3 152.08,144.3 | 147.96,156.21 147.96,157.48 R38.2 | 147.96,149.86 147.96,148.59 R37.2 147.8,148.59 152.08,144.3 | 147.96,154.94 147.96,153.67 | 147.96,153.67 147.96,149.86 | 147.96,149.86 R36.2 | 147.96,153.67 R41.2 | 147.96,154.94 147.96,156.21 | 147.96,156.21 R39.2 | 147.96,154.94 R40.2 | C41.1 157.48,144.15 157.16,143.83 155.89,143.83 155.26,144.46 | C41.1 | 155.26,144.46 C43.1 | 142.08,93.03 143.51,93.03 C17.1 | 131.29,100.17 131.6,99.85 132.08,99.85 C14.1 | 131.29,100.17 130.97,100.49 U$15.1 | 125.73,93.03 125.57,93.03 LVL_D.1 | 125.73,93.03 127,93.03 C13.1 | 125.73,93.03 125.73,98.74 | 125.73,98.74 C1.1 125.73,99.85 125.25,99.85 124.62,100.49 U$5.1 124.46,100.49 123.19,99.22 119.86,99.22 119.38,99.69 C57.1 119.38,99.85 118.9,99.85 | 130.33,99.22 129.86,98.74 125.73,98.74 | 130.33,99.22 131.29,100.17 | 130.33,99.22 135.89,99.22 137.16,100.49 U$8.1 137.32,100.49 137.95,99.85 138.43,99.85 C60.1 138.43,99.69 142.08,96.04 142.08,93.19 LVL_AHI.1 142.08,93.03 | 133.83,106.52 134.14,106.2 134.62,106.2 C63.1 134.62,106.05 136.05,106.05 140.02,110.01 140.02,118.27 142.4,120.65 143.03,120.65 | 133.83,106.52 133.51,106.84 U$17.1 | U$16.1 114.46,106.84 115.09,106.2 115.57,106.2 C4.1 115.57,106.05 118.11,106.05 118.59,105.57 118.9,105.57
  Top 0.152: 118.9,105.57 119.38,105.57 120.65,106.84 U$14.1 120.81,106.84 121.44,106.2 121.92,106.2 C65.1 121.92,106.05 122.4,105.57 125.73,105.57 127,106.84 U$4.1 127.16,106.84 127.79,106.2 128.27,106.2 C5.1 128.27,106.05 128.91,105.41 132.72,105.41 133.83,106.52 | U$1.U8_4 95.09,165.26 95.09,167.64 U$1.U8_3 | 95.09,105.41 95.09,106.68 U$1.U7_3 | 95.09,105.41 95.09,104.3 U$1.U7_4 | 118.9,99.85 118.27,100.49 U$9.1 118.11,100.49 116.68,99.06 112.55,99.06 | 112.55,99.85 111.92,100.49 U$6.1 | 112.55,99.85 113.03,99.85 C6.1 | 111.76,93.03 110.33,93.03 LVL_ALO.1 | 112.55,99.06 112.55,93.82 111.76,93.03 | 112.55,99.06 112.55,99.22 | 112.55,99.22 112.55,99.85 | 111.76,93.03 C3.1 | 95.09,105.41 101.28,105.41 107.47,99.22 112.55,99.22 | 118.9,99.85 118.9,105.57 | 2.22,33.02 2.22,36.2 1.75,36.67 1.75,42.7 2.22,43.18 R124.1 2.38,43.18 2.38,45.72 R123.1 | 80.96,9.21 75.56,9.21 74.61,8.26 69.69,8.26 68.74,9.21 63.82,9.21 SLOT3.A2 | 80.96,9.21 81.44,9.21 SLOT2.A2 80.96,9.21 | 100.49,10.16 96.04,10.16 92.87,6.99 83.19,6.99 80.96,9.21 | 100.49,10.16 101.28,10.16 SLOT1.A3 | 100.49,10.16 100.49,7.46 103.5,4.45 124.78,4.45 135.73,15.4 135.73,19.05 JP3.1 135.89,19.21 136.84,20.16 136.84,22.38 144.78,30.32 144.78,87.47 142.08,90.17 142.08,93.03 | 2.22,33.02 2.22,32.38 1.75,31.91 1.75,21.11 15.56,7.3 46.99,7.3 47.94,8.26 SLOT4.A1 | 2.22,33.02 R122.1
  Bottom 0.152: U$1.U8_4 94.93,165.1 94.93,106.84 U$1.U7_3 | SLOT4.A1 48.1,8.26 49.53,6.83 63.66,6.83 63.66,9.21 SLOT3.A2 63.82,9.37 63.82,10.16 65.72,10.16 SLOT3.A3
+5V  (via drill 0.3)
  Top 0.305: 110.33,87.31 110.33,88.9 110.65,89.22 111.76,89.22 C15.1 | LVL_ALO.23 109.7,87.31 110.17,87.31 LVL_ALO.24 110.33,87.31 | C16.1 143.51,87.31 v142.88,87.31 142.08,87.31 LVL_AHI.24 141.92,87.31 141.45,87.31 LVL_AHI.23 | C18.1 125.57,87.31 LVL_D.24 | LVL_D.23 124.94,87.31 125.41,87.31 LVL_D.24 | 132.16,106.44 131.76,106.05 131.44,106.05 C68.1 | 132.16,106.44 132.56,106.84 U$17.6 | 135.97,100.09 135.57,99.69 135.25,99.69 C67.1 | 135.97,100.09 136.37,100.49 U$8.6 | 125.81,106.44 125.41,106.05 125.09,106.05 C8.1 | 125.81,106.44 126.21,106.84 U$4.6 | 119.46,106.44 119.06,106.05 118.75,106.05 C12.1 | 119.46,106.44 119.86,106.84 U$14.6 | U$5.6 123.67,100.49 v123.19,100.01 122.87,99.69 122.56,99.69 C72.1 | 113.11,106.44 112.71,106.05 112.39,106.05 C11.1 | 113.11,106.44 113.51,106.84 U$16.6 | 116.2,99.69 116.52,99.69 117.32,100.49 U$9.6 | 110.57,100.09 110.17,99.69 109.86,99.69 C9.1 | 110.57,100.09 110.97,100.49 U$6.6 | 129.54,100.33 129.7,100.49 130.02,100.49 U$15.6 | C81.1 55.24,9.21 52.55,9.21 SLOT4.B2 | C56.1 73.03,9.21 70.33,9.21 SLOT3.B2 | C55.1 90.81,9.21 88.11,9.21 SLOT2.B2 | C54.1 108.58,9.21 105.89,9.21 SLOT1.B2 | v111.76,9.21 112.39,9.21 C53.1 | v129.54,99.38 129.54,100.33 | 129.54,100.33 C2.1 | v110.49,100.17 110.57,100.09 | v115.57,99.69 116.2,99.69 | 116.2,99.69 C71.1 | v113.03,106.52 113.11,106.44 | v119.38,106.52 119.46,106.44 | v125.73,106.52 125.81,106.44 | v135.89,100.17 135.97,100.09 | v132.56,106.05 132.16,106.44 | v125.57,86.2 125.57,87.15 LVL_D.24 | v110.97,87.31 110.33,87.31
  Bottom 0.305: JP2.2 18.73,68.26 18.73,104.14 U$1.U7_64
  pour Route2: 45.72,19.05 124.32,19.05 127,21.46 127,83.77 125.7,85.07 95.25,85.07 95.25,95.58 94.46,96.52 15.24,96.52 13.97,97.79 13.97,167.64 15.24,168.91 168.91,168.91 168.91,1.27 45.72,1.27 44.45,2.54 44.45,17.78
ARCH0
  Top 0.152: ARCH_ID.1 R9.1
ARCH1
  Top 0.152: ARCH_ID.2 R8.1
ARCH2
  Top 0.152: ARCH_ID.3 R7.1
ARCH3
  Top 0.152: ARCH_ID.4 R6.1
CTS1
  Top 0.152: SERIAL_BUF0.8 153.19,128.91 157.48,124.62 157.48,122.24 160.5,119.22 160.5,115.57 161.61,114.46 SERIAL0.7
DIR_A  (via drill 0.3)
  Top 0.152: v142.72,94.46 143.19,93.98 R26.1 | LVL_AHI.2 141.45,93.19 v141.45,94.46 140.34,95.57 v126.68,95.57 | v110.97,94.77 110.01,93.82 | 110.01,93.82 109.7,93.5 109.7,93.19 LVL_ALO.2 | v95.57,115.73 92.39,115.73 91.12,114.46 85.09,114.46 81.12,110.49 33.66,110.49 30,106.84 29.05,106.84 U$1.U7_55 | 110.01,93.82 v99.06,104.78
  Route2 0.152: v110.97,94.77 125.89,94.77 v126.68,95.57
  Bottom 0.152: v141.45,94.46 v142.72,94.46 | v95.57,115.73 99.06,112.24 v99.06,104.78
DIR_CLK  (via drill 0.3)
  Top 0.152: U$15.5 129.22,100.97 128.91,101.28 | 128.91,101.28 128.59,101.28 v128.27,100.97 | v56.67,85.25 46.51,85.25 27.46,104.3 27.46,105.73 26.51,106.68 U$1.U7_57 | 128.91,101.28 R2.1
  Route2 0.152: v127,81.12 125.89,82.23 114.62,82.23 113.35,80.96 60.96,80.96 v56.67,85.25
  Bottom 0.152: v128.27,100.97 127.64,100.33 127.64,83.03 127,82.39 v127,81.12
DIR_D  (via drill 0.3)
  Top 0.152: v126.68,94.77 126.68,93.98 R25.1 | v126.68,91.76 125.73,91.76 124.94,92.55 124.94,93.03 LVL_D.2 | v73.5,82.71 47.94,82.71 26.51,104.14 U$1.U7_58
  Route2 0.152: v126.68,91.76 126.05,91.76 122.87,88.58 122.87,88.11 117.47,82.71 v73.5,82.71
  Bottom 0.152: v126.68,91.76 v126.68,94.77
DIR_EXTSEL  (via drill 0.3)
  Top 0.152: U$5.5 122.87,100.97 122.56,101.28 | v121.76,101.28 122.56,101.28 | v112.39,127.16 99.06,127.16 86.68,114.78 31.91,114.78 23.97,106.84 U$1.U7_59 | 122.56,101.28 R3.1
  Bottom 0.152: v121.76,101.28 120.97,102.08 120.97,110.01 119.86,111.12 119.86,135.89 118.75,137 112.39,137 v112.39,127.16
DIR_HALT  (via drill 0.3)
  Top 0.152: U$8.5 v135.89,100.97 135.57,100.97 135.25,101.28 R19.1 | v136.05,135.41 132.72,135.41 130.33,133.03 119.86,133.03 114.62,127.79 99.22,127.79 86.52,115.09 30.64,115.09 22.7,107.16 22.7,105.41 23.81,104.3 U$1.U7_60
  Bottom 0.152: v135.89,100.97 136.84,101.92 136.84,105.25 136.05,106.05 v136.05,135.41
DIR_IRQ  (via drill 0.3)
  Top 0.152: U$6.5 110.17,100.97 109.86,101.28 R4.1 109.86,101.44 108.74,101.44 v104.78,105.41 | v101.12,154.62 101.12,155.1 90.96,165.26 90.96,166.69 90.01,167.64 U$1.U8_7
  Bottom 0.152: v104.78,105.41 101.12,109.06 v101.12,154.62
DIR_MPD  (via drill 0.3)
  Top 0.152: U$4.5 125.41,107.31 125.09,107.63 | v123.83,107.63 125.09,107.63 | v120.49,134.46 119.7,134.46 110.81,143.35 110.81,144.15 89.85,165.1 U$1.U8_8 | 125.09,107.63 R5.1
  Bottom 0.152: v123.83,107.63 120.49,110.97 v120.49,134.46
DIR_RD4  (via drill 0.3)
  Top 0.152: U$16.5 112.71,107.31 112.39,107.63 | v111.44,107.63 112.39,107.63 | v110.17,143.51 88.42,165.26 88.42,166.69 87.47,167.64 U$1.U8_9 | 112.39,107.63 R10.1
  Bottom 0.152: v111.44,107.63 110.97,108.11 110.97,142.72 v110.17,143.51
DIR_RD5  (via drill 0.3)
  Top 0.152: U$14.5 v119.38,107.31 119.06,107.31 118.75,107.63 R13.1 | v119.22,133.19 87.31,165.1 U$1.U8_10
  Bottom 0.152: v119.38,107.31 119.22,107.47 v119.22,133.19
DIR_RST  (via drill 0.3)
  Top 0.152: 132.08,107.31 131.76,107.31 131.44,107.63 R21.1 | 132.08,107.31 U$17.5 | 132.08,107.31 132.08,108.11 131.92,108.27 131.92,108.43 131.13,109.22 121.13,109.22 v118.27,112.08 | v117.79,132.24 84.93,165.1 U$1.U8_12
  Bottom 0.152: v118.27,112.08 117.79,112.55 v117.79,132.24
DIR_RW  (via drill 0.3)
  Top 0.152: U$9.5 116.52,100.97 116.2,101.28 | v115.41,101.28 116.2,101.28 | v114.3,131.6 81.12,164.78 81.12,166.53 82.23,167.64 U$1.U8_13 | 116.2,101.28 R22.1
  Bottom 0.152: v115.41,101.28 114.3,102.39 v114.3,131.6
GND  (via drill 0.3)
  Top 0.152: v156.53,145.41 156.53,146.21 157.32,147 SD_SLOT.GND4 | v156.53,145.41 156.53,144.46 C43.2 | 152.72,144.78 153.67,144.78 C42.2 | 152.72,144.78 152.4,144.78 C134.1 | 152.72,146.84 152.72,147.48 SD_SLOT.GND1 152.72,146.84 | 152.72,146.84 152.72,145.41 | 152.72,145.41 152.72,144.78 | 149.54,150.97 149.54,150.02 152.72,146.84 | 149.54,150.97 149.54,153.51 152.56,156.53 SD_SLOT.GND3 | 149.54,150.97 164.15,150.97 SD_SLOT.P$6 | 152.72,145.41 v156.53,145.41 | U$15.2 131.44,100.97 132.08,100.33 | 132.08,100.33 133.51,100.33 | 133.51,100.33 v134.46,100.33 135.25,100.33 C67.2 | 132.08,100.33 C14.2 | 133.51,100.33 134.94,101.76 135.25,101.76 R19.2 135.25,103.03 134.62,103.66 128.91,103.66 | 120.02,100.33 122.56,100.33 C72.2 | 120.02,100.33 119.38,100.33 C57.2 | 122.56,101.92 121.6,101.92 120.02,100.33 | U$5.2 125.09,100.97 125.73,100.33 | 125.73,100.33 126.84,100.33 | 126.84,100.33 C2.2 | 125.73,100.33 C1.2 | 126.84,100.33 128.27,101.76 128.91,101.76 R2.2 128.91,103.66 | 122.56,101.92 125.41,104.78 127.79,104.78 128.91,103.66 | 122.56,101.92 R3.2 | C17.2 143.51,92.55 143.83,92.55 143.99,92.71 143.99,93.82 143.83,93.98 R26.2 143.67,93.98 143.67,95.25 138.75,100.17 138.43,100.17 C60.2 138.43,100.33 v137.79,100.97 U$8.2 | 127.48,93.19 127.48,93.82 127.32,93.98 R25.2 | 127.48,93.19 127.48,92.71 127.32,92.55 127,92.55 C13.2 | 127.48,93.19 v130.33,93.19 134.78,93.19 LVL_AHI.12 134.94,93.19 135.41,93.19 LVL_AHI.11 | 111.76,108.27 112.39,108.27 R10.2 | 111.76,108.27 111.28,108.27 110.81,107.79 110.81,107.47 v111.44,106.84 111.6,106.68 112.39,106.68 C11.2 | U$16.2 114.94,107.31 115.57,106.68 | 115.57,106.68 116.2,106.68
  Top 0.152: 116.2,106.68 117,106.68 | 117,106.68 118.75,106.68 C12.2 | 115.57,106.68 C4.2 | 117,106.68 118.43,108.11 118.75,108.11 R13.2 | 111.76,108.27 111.76,109.06 112.24,109.54 113.35,109.54 116.2,106.68 | C18.2 127.32,87.31 128.75,88.74 131.13,88.74 | 131.13,88.74 133.35,88.74 134.78,87.31 LVL_AHI.13 | 109.86,9.84 108.58,9.84 C54.2 | 112.39,9.84 113.67,9.84 R61.1 113.67,9.68 116.68,9.68 117,9.37 SLOT0.A2 | 112.39,9.84 111.12,9.84 | 111.12,9.84 109.86,9.84 | 109.86,9.84 R62.1 | 112.39,9.84 C53.2 | 111.12,5.08 112.39,5.08 113.03,5.71 LD_0P1.C | 111.12,5.08 109.22,5.08 108.58,5.71 LD_1P.C | 111.12,5.08 111.12,9.84 | v112.39,100.97 U$6.2 | 113.03,100.33 v112.39,100.97 | v112.39,100.97 112.39,101.92 | 112.39,101.92 112.39,103.5 112.87,103.98 116.36,103.98 118.59,101.76 118.59,101.28 118.27,100.97 U$9.2 | 113.03,100.33 116.2,100.33 C71.2 | 113.03,100.33 C6.2 | 112.39,101.92 116.2,101.92 R22.2 | 2.38,26.67 v2.38,25.4 2.38,24.13 R6.2 | 2.38,29.21 2.38,31.75 R9.2 | 2.38,29.21 2.38,26.67 | 2.38,26.67 R7.2 | 2.38,29.21 R8.2 | 105.09,86.52 108.58,86.52 108.9,86.84 108.9,87.15 LVL_ALO.22 | 105.09,86.52 103.5,86.52 103.19,86.84 103.19,87.15 LVL_ALO.13 | C41.2 167.16,144.15 v167.16,145.73 167.16,147.16 SD_SLOT.GND0 | 128.27,106.68 127.79,106.68 127.16,107.31 U$4.2 | 128.27,106.68 129.7,106.68 | 129.7,106.68 v130.49,106.68 131.44,106.68 C68.2 | 128.27,106.68 C5.2 | 129.7,106.68 131.13,108.11 131.44,108.11 R21.2 | 143.83,120.97 145.1,120.97 145.41,121.28 SERIAL_BUF0.15 | 143.83,120.97 143.51,120.97 C94.1 | 2.38,39.37 v2.38,38.1 2.38,36.83 R14.2 | 2.38,39.37 2.38,41.91 R16.2 | 2.38,39.37 R15.2 | U$14.2 121.28,107.31 121.92,106.68
  Top 0.152: 121.92,106.68 v123.19,106.68 125.09,106.68 C8.2 | 121.92,106.68 C65.2 | 142.88,87.95 142.4,87.95 142.24,88.11 141.13,88.11 140.81,87.79 140.81,87.31 LVL_AHI.22 | 142.88,87.95 143.51,87.95 C16.2 | R17.2 2.38,46.99 v2.38,48.26 2.38,49.53 R18.2 | LVL_D.11 118.9,93.19 118.43,93.19 LVL_D.12 118.27,93.19 v118.27,94.14 | LVL_ALO.11 103.66,93.19 103.19,93.19 LVL_ALO.12 103.03,93.19 v102.39,93.19 | 134.62,106.68 134.14,106.68 133.51,107.31 U$17.2 | 91.28,9.84 92.08,9.84 R63.1 | 91.28,9.84 90.81,9.84 C55.2 | 73.82,9.84 74.3,9.84 R64.1 | 73.82,9.84 73.03,9.84 C56.2 | 56.04,9.84 56.52,9.84 R65.1 | 56.04,9.84 55.24,9.84 C81.2 | v110.97,88.58 111.76,88.58 C15.2 | v112.39,92.55 111.76,92.55 C3.2 | 101.12,106.05 100.49,106.68 97.63,106.68 U$1.U7_1 | 101.12,106.05 106.84,100.33 109.86,100.33 C9.2 | v153.99,122.56 153.99,121.92 C92.2 | C91.2 153.99,127 v153.99,126.36 153.35,125.73 150.5,125.73 149.22,124.46 144.46,124.46 143.83,123.83 143.83,120.97 | 101.12,106.05 104.93,106.05 109.06,101.92 109.86,101.92 R4.2 | v124.3,108.27 125.09,108.27 R5.2 | LD_4P.C 51.75,5.71 48.9,8.57 48.9,9.37 48.1,10.16 SLOT4.A3 | LD_3P.C 68.42,5.71 65.88,8.26 SLOT3.A1 65.72,8.26 56.83,8.26 56.04,9.05 56.04,9.84 | LD_2P.C 90.81,5.71 91.44,5.08 95.09,5.08 99.22,9.21 SLOT1.A2 | 73.82,9.84 73.82,9.05 73.98,8.89 74.77,8.89 76.99,11.11 81.44,11.11 SLOT2.A4 | 91.28,9.84 91.28,9.05 89.53,7.3 84.61,7.3 83.66,8.26 SLOT2.A1 | v135.41,106.68 134.62,106.68 | 134.62,106.68 C63.2 | v118.27,88.27 118.27,87.31 LVL_D.13 | v124.3,86.2 124.3,87.15 LVL_D.22 | JP1.49 167,163.19 167,160.18 SD_SLOT.GND2 | v142.88,88.11 142.88,87.95 | v105.09,86.2 105.09,86.52
  Top 0.152: v131.13,88.58 131.13,88.74
  pour Route15: -2.54,172.72 172.72,172.72 172.72,-2.54 -2.54,-2.54
HBUS0  (via drill 0.3)
  Top 0.152: v98.27,27.3 88.11,27.3 SLOT2.B18 | SLOT0.B18 123.67,27.15 126.36,27.15 132.87,20.64 134.78,20.64 135.73,21.59 JP3.3 | 58.58,27.15 62.55,27.15 63.5,26.19 64.61,26.19 65.56,25.24 66.36,25.24 v67.15,26.04 | 58.58,27.15 52.55,27.15 SLOT4.B18 | v54.13,157.8 46.83,165.1 U$1.U8_42 | 58.58,27.15 v58.58,27.46 | v79.85,27.46 70.48,27.46 70.33,27.3 SLOT3.B18
  Route2 0.152: v98.27,27.3 99.06,28.1 100.33,28.1 101.28,27.15 104.46,27.15 104.62,26.99 105.57,26.99 105.73,27.15 SLOT1.B18 105.89,27.3 107,27.3 109.86,30.16 118.11,30.16 119.22,29.05 119.7,29.05 121.44,27.3 123.51,27.3 SLOT0.B18
  Route15 0.152: v79.85,27.46 80.96,26.35 81.76,26.35 82.55,27.15 87.95,27.15 SLOT2.B18
  Bottom 0.152: v67.15,26.04 67.31,26.19 67.31,26.51 67.94,27.15 70.17,27.15 SLOT3.B18 | v54.13,157.8 58.26,153.67 58.26,27.78 v58.58,27.46
HBUS1  (via drill 0.3)
  Top 0.152: SLOT0.B19 121.76,28.26 126.68,28.26 133.19,21.75 JP3.4 | SLOT2.B19 86.2,28.26 100.01,28.26 100.97,29.21 103.03,29.21 103.82,28.42 SLOT1.B19 | 56.04,29.37 62.39,29.37 63.5,28.26 64.45,28.26 65.41,27.3 67.15,27.3 68.26,28.42 SLOT3.B19 | 56.04,29.37 54.61,29.37 53.5,28.26 50.64,28.26 SLOT4.B19 | v55.4,154.78 45.56,164.62 45.56,165.58 46.67,166.69 46.67,167.64 U$1.U8_41 | 56.04,29.37 v56.04,28.73
  Route15 0.152: SLOT2.B19 86.04,28.42 84.93,28.42 83.98,27.46 82.55,27.46 81.92,28.1 68.58,28.1 68.42,28.26 SLOT3.B19 | SLOT0.B19 121.6,28.42 120.17,28.42 119.22,29.37 118.11,29.37 117.32,30.16 105.41,30.16 103.98,28.73 103.98,28.42 SLOT1.B19
  Bottom 0.152: v55.4,154.78 55.72,154.46 55.72,29.05 v56.04,28.73
HBUS2  (via drill 0.3)
  Top 0.152: v98.27,29.69 97.95,29.37 88.11,29.37 SLOT2.B20 | SLOT0.B20 123.67,29.21 126.68,29.21 132.72,23.18 134.78,23.18 135.73,24.13 JP3.5 | v69.06,145.41 49.37,165.1 U$1.U8_40 | v94.77,46.67 81.76,46.67 80.01,48.42 v70.96,48.42
  Route2 0.152: v98.27,29.69 98.58,29.69 99.06,30.16 100.33,30.16 101.12,29.37 105.73,29.37 SLOT1.B20 105.89,29.37 106.68,29.37 111.44,34.13 118.11,34.13 119.22,33.02 119.7,33.02 121.6,31.11 121.92,31.11 123.67,29.37 SLOT0.B20 | SLOT4.B20 52.55,29.37 62.55,29.37 63.5,28.42 64.77,28.42 65.56,29.21 70.17,29.21 SLOT3.B20
  Bottom 0.152: v69.06,145.41 70.64,143.83 70.64,48.42 | 70.64,48.42 70.64,42.86 69.37,41.59 69.37,30.16 70.17,29.37 SLOT3.B20 | v98.27,29.69 94.77,33.18 v94.77,46.67 | 70.64,48.42 v70.96,48.42
HBUS3  (via drill 0.3)
  Top 0.152: SLOT2.B21 86.2,30.32 100.17,30.32 101.12,31.27 102.87,31.27 103.82,30.32 SLOT1.B21 | SLOT0.B21 121.76,30.16 126.21,30.16 128.27,28.1 129.38,28.1 133.19,24.29 JP3.6 | v116.05,33.02 v108.11,33.02 | SLOT3.B21 68.26,30.32 67.31,29.37 65.41,29.37 64.61,30.16 50.64,30.16 SLOT4.B21 50.48,30.32 49.53,31.27 47.78,31.27 46.83,32.23 45.72,32.23 42.86,35.08 v42.86,39.69
  Route2 0.152: v116.05,33.02 117,32.07 118.27,32.07 119.22,31.11 119.38,31.11 120.17,30.32 121.6,30.32 SLOT0.B21
  Route15 0.152: SLOT2.B21 86.04,30.32 85.25,31.11 82.55,31.11 81.6,30.16 68.42,30.16 SLOT3.B21
  Bottom 0.152: v108.11,33.02 108.11,30.32 103.98,30.32 SLOT1.B21 | v42.86,39.69 42.86,42.07 43.02,42.23 43.02,107.16 47.78,111.92 47.78,166.21 49.21,167.64 U$1.U8_39
HBUS4  (via drill 0.3)
  Top 0.152: JP3.7 135.73,26.67 134.78,25.72 132.87,25.72 132.24,26.35 132.24,27.3 131.13,28.42 128.43,28.42 125.73,31.11 123.67,31.11 SLOT0.B22 123.51,31.27 v120.02,31.27 | v62.71,31.27 52.55,31.27 SLOT4.B22 | v114.94,29.53 108.74,29.53 107.16,31.11 105.89,31.11 SLOT1.B22
  Route2 0.152: v62.71,31.27 63.5,32.07 64.93,32.07 65.56,31.43 70.01,31.43 70.17,31.27 SLOT3.B22 70.33,31.11 70.96,30.48 81.92,30.48 82.55,31.11 87.95,31.11 SLOT2.B22 88.11,31.11 88.74,30.48 99.69,30.48 100.33,31.11 105.73,31.11 SLOT1.B22
  Bottom 0.152: U$1.U8_38 51.91,165.26 52.55,165.89 52.55,167 53.18,167.64 53.18,168.12 53.98,168.91 57.94,168.91 57.94,167.32 56.99,166.37 56.04,166.37 56.04,165.89 55.72,165.58 55.72,160.34 53.5,158.12 53.5,107.47 53.18,107.16 53.18,43.34 54.61,41.91 54.61,33.34 52.55,31.27 SLOT4.B22 | v120.02,31.27 118.11,31.27 118.11,31.59 117.47,32.23 114.94,32.23 v114.94,29.53
HBUS5  (via drill 0.3)
  Top 0.152: SLOT1.B23 103.98,32.38 103.98,32.7 105.41,34.13 117.95,34.13 118.9,33.18 120.81,33.18 121.6,32.38 SLOT0.B23 121.76,32.23 125.09,32.23 128.59,28.73 131.29,28.73 133.19,26.83 JP3.8 | 68.1,32.07 68.26,32.23 SLOT3.B23 68.1,32.07 | 68.1,32.07 67.31,31.27 65.56,31.27 64.61,32.23 50.64,32.23 SLOT4.B23 | 68.1,32.07 69.85,30.32 81.92,30.32 82.87,31.27 83.98,31.27 84.93,32.23 86.04,32.23 SLOT2.B23 | v90.01,37.62 v97.16,37.62
  Bottom 0.152: U$1.U8_37 51.75,167.64 50.32,166.21 50.32,111.92 45.24,106.84 45.24,95.25 44.77,94.77 44.77,35.24 45.88,34.13 47.15,34.13 47.15,33.81 47.78,33.18 49.85,33.18 49.85,33.02 50.48,32.38 SLOT4.B23 | v97.16,37.62 96.84,37.94 96.84,46.2 101.6,46.2 104.14,43.66 104.14,42.39 102.87,41.12 102.87,33.34 103.82,32.38 SLOT1.B23 | v90.01,37.62 89.06,36.67 89.06,34.92 88.27,34.13 87,34.13 87,33.18 86.2,32.38 SLOT2.B23
HBUS6  (via drill 0.3)
  Top 0.152: SLOT0.B24 123.67,33.18 124.94,33.18 129.06,29.05 132.08,29.05 132.87,28.26 134.78,28.26 135.73,29.21 JP3.9 | v62.71,33.66 62.39,33.34 52.55,33.34 SLOT4.B24 | v69.06,150.5 54.45,165.1 U$1.U8_36
  Route2 0.152: SLOT1.B24 105.73,33.18 101.28,33.18 100.33,34.13 99.06,34.13 98.27,33.34 88.11,33.34 SLOT2.B24 87.95,33.34 85.72,33.34 83.98,35.08 82.55,35.08 81.92,34.45 71.44,34.45 70.33,33.34 SLOT3.B24 70.17,33.34 65.56,33.34 64.77,34.13 63.5,34.13 63.02,33.66 v62.71,33.66 | v108.11,36.99 115.25,36.99 116.36,38.1 117.47,38.1 118.11,37.47 122.08,37.47 122.71,38.1 123.98,38.1 124.46,37.62 124.46,34.92 123.67,34.13 123.67,33.34 SLOT0.B24
  Bottom 0.152: v108.11,36.99 106.84,35.72 106.84,34.29 105.89,33.34 SLOT1.B24 | v69.06,150.5 70.96,148.59 70.96,102.39 71.6,101.76 71.6,34.61 70.33,33.34 SLOT3.B24
HBUS7
  Top 0.152: SLOT0.B25 121.76,34.13 124.46,34.13 129.22,29.37 133.19,29.37 JP3.10 | SLOT1.B25 103.82,34.13 103.03,33.34 100.97,33.34 100.17,34.13 99.22,34.13 98.74,34.61 98.27,34.61 97.95,34.29 86.2,34.29 SLOT2.B25 86.04,34.13 84.77,34.13 83.98,33.34 82.87,33.34 81.92,34.29 81.28,34.29 80.49,35.08 71.44,35.08 70.64,34.29 68.42,34.29 SLOT3.B25 68.26,34.13 67.47,33.34 65.41,33.34 64.45,34.29 50.64,34.29 SLOT4.B25
  Route2 0.152: SLOT0.B25 121.6,34.29 120.33,34.29 119.54,35.08 118.11,35.08 117.47,34.45 104.14,34.45 103.98,34.29 SLOT1.B25
  Bottom 0.152: U$1.U8_35 54.29,167.64 52.86,166.21 52.86,112.39 47.78,107.31 47.78,44.13 47.47,43.81 47.47,42.07 49.21,40.32 49.21,35.72 50.48,34.45 50.48,34.29 SLOT4.B25
HBUS8
  Top 0.152: SLOT1.B26 105.89,35.4 116.05,35.4 116.84,36.2 117.95,36.2 118.9,35.24 123.51,35.24 SLOT0.B26 123.67,35.4 128.27,30.8 133.67,30.8 134.62,31.75 135.73,31.75 JP3.11
  Route2 0.152: SLOT4.B26 52.55,35.24 53.34,34.45 64.93,34.45 65.72,35.24 70.17,35.24 SLOT3.B26 70.33,35.4 70.96,36.04 81.92,36.04 82.55,35.4 87.95,35.4 SLOT2.B26 88.11,35.4 88.74,36.04 99.69,36.04 100.33,35.4 105.73,35.4 SLOT1.B26
  Bottom 0.152: U$1.U8_34 56.99,165.26 58.42,166.69 60.8,166.69 60.8,168.12 61.59,168.91 73.5,168.91 73.5,163.35 80.8,156.05 80.8,106.36 80.49,106.05 80.49,105.41 81.12,104.78 81.12,48.9 87.15,42.86 87.15,36.2 87.95,35.4 SLOT2.B26
HBUS9
  Top 0.152: JP3.12 133.19,31.91 128.91,36.2 121.76,36.2 SLOT0.B27 121.6,36.35 120.33,36.35 119.38,37.31 118.43,37.31 117.47,38.26 108.11,38.26 106.2,36.35 103.98,36.35 SLOT1.B27 103.82,36.35 103.03,37.15 100.97,37.15 100.17,36.35 86.2,36.35 SLOT2.B27 86.04,36.35 84.77,36.35 83.98,37.15 82.71,37.15 81.92,36.35 68.42,36.35 SLOT3.B27 68.26,36.2 67.31,35.24 65.56,35.24 64.61,36.2 50.64,36.2 SLOT4.B27
  Bottom 0.152: U$1.U8_33 56.83,167.64 55.4,166.21 55.4,160.5 53.18,158.27 53.18,112.24 48.1,107.16 48.1,43.97 47.78,43.66 47.78,42.39 49.53,40.64 49.53,37.31 50.48,36.35 SLOT4.B27
HBUS10  (via drill 0.3)
  Top 0.152: v127.32,37.15 123.67,37.15 SLOT0.B28 | v51.28,87.95 35.4,103.82 35.4,104.3 34.13,105.57 34.13,106.68 U$1.U7_51
  Route2 0.152: SLOT4.B28 52.55,37.15 56.99,37.15 57.78,36.35 64.77,36.35 65.56,37.15 70.17,37.15 SLOT3.B28 70.33,37.15 71.12,36.35 81.76,36.35 82.55,37.15 87.95,37.15 SLOT2.B28 88.11,37.31 89.06,38.26 99.54,38.26 100.65,37.15 105.73,37.15 SLOT1.B28 105.89,37.15 106.68,36.35 117.32,36.35 118.11,37.15 123.51,37.15 SLOT0.B28
  Bottom 0.152: v127.32,37.15 131.29,33.18 135.73,33.18 135.73,34.29 JP3.13 | v51.28,87.95 52.86,86.36 52.86,43.18 54.29,41.75 54.29,38.73 52.86,37.31 52.55,37.31 SLOT4.B28
HBUS11  (via drill 0.3)
  Top 0.152: JP3.14 133.19,34.45 131.29,34.45 127.48,38.26 121.76,38.26 SLOT0.B29 121.6,38.42 121.6,39.05 120.65,40.01 120.65,41.12 121.92,42.39 121.92,43.66 120.97,44.61 118.9,44.61 118.43,44.13 117.47,44.13 117,43.66 117,43.34 119.06,41.27 119.38,41.27 120.02,40.64 120.02,39.85 119.54,39.37 118.27,39.37 117.47,40.16 105.09,40.16 103.82,38.89 | 68.26,38.89 68.26,38.42 SLOT3.B29 68.26,38.89 | 68.26,38.89 68.26,39.05 65.09,42.23 58.26,42.23 56.36,40.32 52.23,40.32 50.64,38.73 50.64,38.42 SLOT4.B29 | 85.88,38.42 84.77,38.42 83.82,39.37 82.71,39.37 81.92,40.16 69.53,40.16 68.26,38.89 | 85.88,38.42 86.04,38.42 SLOT2.B29 85.88,38.42 | 103.82,38.89 103.82,39.05 100.81,42.07 99.85,42.07 99.69,42.23 90.33,42.23 88.27,40.16 87.63,40.16 85.88,38.42 | 103.82,38.89 103.82,38.42 SLOT1.B29 103.82,38.89 | v50.16,85.88 50.16,87.47 34.13,103.5 34.13,104.14 U$1.U7_52
  Bottom 0.152: v50.16,85.88 51.44,84.61 51.44,39.21 50.64,38.42 SLOT4.B29
HBUS12  (via drill 0.3)
  Top 0.152: v124.3,42.23 124.62,42.23 128.75,38.1 134.62,38.1 135.73,36.99 JP3.15 | SLOT2.B30 88.11,39.37 98.11,39.37 98.9,40.16 100.17,40.16 101.12,39.21 101.76,39.21 102.87,38.1 102.87,37.94 103.5,37.31 104.14,37.31 105.73,38.89 105.73,39.21 SLOT1.B30 | v64.61,40.16 63.34,40.16 63.02,39.85 53.82,39.85 53.34,39.37 52.55,39.37 SLOT4.B30 | v49.21,87.63 32.86,103.98 32.86,104.3 31.59,105.57 31.59,106.68 U$1.U7_53
  Route2 0.152: SLOT0.B30 123.51,39.37 118.59,39.37 117.47,40.48 107,40.48 105.89,39.37 SLOT1.B30 | v64.61,40.16 65.41,39.37 70.17,39.37 SLOT3.B30 70.33,39.21 71.12,38.42 81.92,38.42 82.71,39.21 87.95,39.21 SLOT2.B30
  Bottom 0.152: v124.3,42.23 124.62,41.91 124.62,40.32 123.67,39.37 SLOT0.B30 | v49.21,87.63 51.91,84.93 51.91,43.18 53.5,41.59 53.5,40.32 52.55,39.37 SLOT4.B30
HBUS13  (via drill 0.3)
  Top 0.152: SLOT0.B31 121.76,40.16 126.21,40.16 129.38,36.99 133.19,36.99 JP3.16 | 68.1,40.32 68.26,40.32 SLOT3.B31 68.1,40.32 | 68.1,40.32 67.63,40.32 65.41,42.55 52.55,42.55 50.64,40.64 50.64,40.32 SLOT4.B31 | 85.88,40.32 85.25,40.32 83.03,42.55 70.33,42.55 68.1,40.32 | 85.88,40.32 86.04,40.32 SLOT2.B31 85.88,40.32 | 85.88,40.32 88.11,42.55 99.85,42.55 100.01,42.39 100.97,42.39 103.03,40.32 103.82,40.32 SLOT1.B31 | v49.21,86.52 31.59,104.14 U$1.U7_54
  Route2 0.152: SLOT0.B31 121.6,40.32 120.17,40.32 118.43,42.07 105.57,42.07 103.82,40.32 SLOT1.B31
  Bottom 0.152: v49.21,86.52 49.53,86.2 49.53,44.93 50.8,43.66 50.8,40.48 50.64,40.32 SLOT4.B31
HI_A0  (via drill 0.3)
  Top 0.152: v147.16,15.72 145.1,15.72 140.97,19.84 140.97,21.43 U$3.PA1 | v108.74,88.27 108.43,87.95 108.43,87.31 LVL_ALO.21 | v111.12,151.92 111.12,154.94 120.81,164.62 120.81,166.53 JP1.16 | v160.02,57.31 160.02,84.14 139.54,104.62 v139.38,104.62 | v139.38,110.17 126.36,110.17 123.51,113.03 v110.33,113.03
  Route15 0.152: v160.02,57.31 155.1,62.23 CARTRIDGE.P5
  Bottom 0.152: v147.16,15.72 153.51,15.72 153.51,15.4 154.78,14.13 160.02,14.13 v160.02,57.31 | v108.74,88.27 108.27,88.74 108.27,91.28 107.63,91.92 107.63,113.03 | 107.63,113.03 107.63,147.48 111.12,150.97 v111.12,151.92 | v139.38,110.17 v139.38,104.62 | 107.63,113.03 v110.33,113.03
HI_A1  (via drill 0.3)